# Altium project GN-1866-A-V2_HI3519V101.PRJPCB (part 1 of 4)
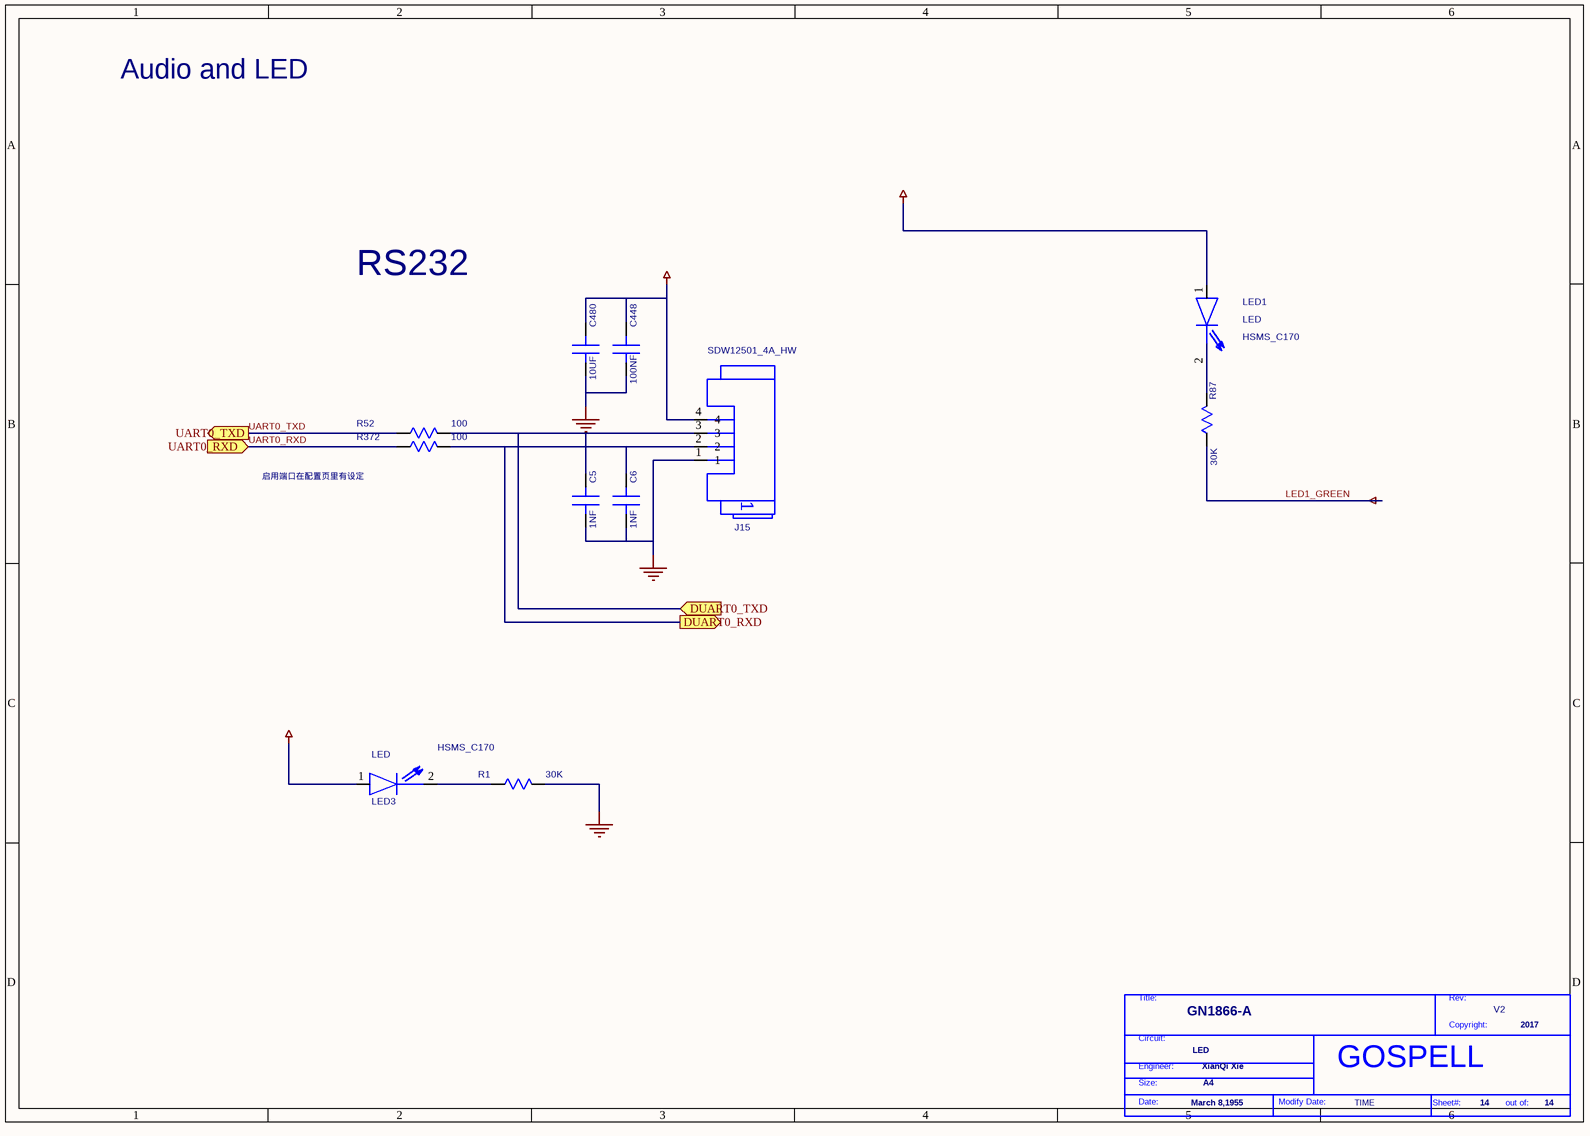
[diagram p0: P14 LED.SchDoc]
14 sheets, 339 parts. Net scope: flat (ports and power ports of the same name join across sheets).
Board file: GN-1866-A-V2.PCBDOC
Sheets:
  P14 LED.SchDoc
  P13 CONNECT.SchDoc
  P12 Spi Nor Flash.SchDoc
  P11 Peripheral of Hi351.SchDoc
  P10 VI Hi3519.SchDoc
  P09 SYS of Hi3519.SchDoc
  P08 DDR3.SchDoc
  P07 DDRC of Hi3519.SchDoc
  P06 Power&GND of Hi3519.SchDoc
  P05 Power 2.SchDoc
  P04 Power 1.SchDoc
  P03 Power Tree.SchDoc
  P02 Block Diagram.SchDoc
  P01 Note & Title.SchDoc

## Sheet P14 LED.SchDoc
size 297 x 209 mm

### Parts
(Parts that share a designator on the sheet are numbered #1, #2 ... from top to bottom, then left to right.)
*#1  Page Modify Date: TIME  Engineer: XianQi Xie  Copyright: 2017  Title: GN1866-A  RevCode: V2  Page Size: A4  Page Create Date: March 8,1955  Page Number: 14  Doc: LED  (hidden comment: GOSPELL)  (graphical)
C5  1NF  [SC0402]
C6  1NF  [SC0402]
C448  100NF  [SC0402]
C480  10UF  [SC0603]
J15  DEVICE: SDW12501_4A_HW  [4PIN-254]  (hidden comment: WBC1X41)
LED1  LED  DEVICE: HSMS_C170  [SD0805-LED]
LED3  LED  DEVICE: HSMS_C170  [SD0805-LED]
R1  30K  [SR0402]
R52  100  [SR0402]
R87  30K  [SR0402]
R372  100  [SR0402]

### Ports
DUART0_RXD (out), DUART0_TXD (in), UART0_RXD (in), UART0_TXD (out)

### Nets
3V3: C448.1(A) C480.1(A) J15.4 LED1.1(A) LED3.1(A)
GND: C5.2(B) C6.2(B) C448.2(B) C480.2(B) J15.1 R1.2(B)
LED1_GREEN: R87.1(A)
UART0_RXD: R372.1(A) ; port UART0_RXD
UART0_TXD: R52.1(A) ; port UART0_TXD
NetC5_1: C5.1(A) J15.3 R52.2(B) ; port DUART0_TXD
NetC6_1: C6.1(A) J15.2 R372.2(B) ; port DUART0_RXD
NetLED1_2: LED1.2(B) R87.2(B)
NetLED3_2: LED3.2(B) R1.1(A)

### Notes on the sheet
- Audio and LED
- RS232
- 启用端口在配置页里有设定
- (in symbol GOSPELL) Title:; Rev:; Copyright:; Circuit:; Engineer:; Size:; Date:; Modify Date:; Sheet#:; out of:

### Library data of the parts
C5 = C_0: PARTS: 1; PINSWAP: (A,B); LEVEL: STD; DEVICE: 04025C102KAT2A; OriginalSymbolOrigin: (0,30); CODE: 8070531; %195%%232%%202%%246%: SMD陶瓷电容-50V-1NF-+/-10%-X7R-0402-BT; %182%%238%%182%%168%%185%%164%%215%%247%%181%%231%%209%%185%(V): 50; COMPONENT_HIGH_MAX: 0.56MM; %208%%161%%192%%224%%195%%251%%179%%198%: SMD陶瓷电容; GVALUE: C  50V  1000pF +80%~-20%  X7R 0402; PKG_TYPE: SC0402
C6 = C_0: PARTS: 1; PINSWAP: (A,B); LEVEL: STD; DEVICE: 04025C102KAT2A; OriginalSymbolOrigin: (0,30); GVALUE: C  50V  1000pF +80%~-20%  X7R 0402; CODE: 8070531; %195%%232%%202%%246%: SMD陶瓷电容-50V-1NF-+/-10%-X7R-0402-BT; %182%%238%%182%%168%%185%%164%%215%%247%%181%%231%%209%%185%(V): 50; COMPONENT_HIGH_MAX: 0.56MM; %208%%161%%192%%224%%195%%251%%179%%198%: SMD陶瓷电容; PKG_TYPE: SC0402
C448 = C_0_Dup1: PARTS: 1; OriginalSymbolOrigin: (0,30); DEVICE: RMEMK105BJ104KV_FR; LEVEL: STD; PINSWAP: (A,B); CODE: 8070614; %195%%232%%202%%246%: SMD陶瓷电容-16V-100NF-+/-10%-X7R-0402-BT; %182%%238%%182%%168%%185%%164%%215%%247%%181%%231%%209%%185%(V): 16; COMPONENT_HIGH_MAX: 0.55MM; %208%%161%%192%%224%%195%%251%%179%%198%: SMD陶瓷电容; GVALUE: C 16V  0.1uF +80%~-20%  X7R 0402; PKG_TYPE: SC0402
C480 = C_0_Dup1: PARTS: 1; OriginalSymbolOrigin: (0,30); DEVICE: C1608X5R0J106MT0A0E; LEVEL: STD; PINSWAP: (A,B); GVALUE: C  6.3V  10uF +80%~-20%  X5R 0603; %208%%161%%192%%224%%195%%251%%179%%198%: SMD陶瓷电容; COMPONENT_HIGH_MAX: 0.9MM; %182%%238%%182%%168%%185%%164%%215%%247%%181%%231%%209%%185%(V): 6.3; %195%%232%%202%%246%: SMD陶瓷电容-6.3V-10000NF-+/-20%-X5R-0603-BT,TS16949; CODE: 8070649; PKG_TYPE: SC0603
J15 = WBC1X41_0: PARTS: 1; LEVEL: STD; PKG_TYPE: WBC0104-49T; CODE: 14100167; OriginalSymbolOrigin: (10,130); GVALUE: NC; %195%%232%%202%%246%: 普通插座-4PIN-单排-直式-1.25MM-2MM-THT-1A; COMPONENT_HIGH_MAX: 4.2MM; %208%%161%%192%%224%%195%%251%%179%%198%: 普通插座
LED1 = LED_1: PARTS: 1; OriginalSymbolOrigin: (10,20); CODE: 15020062; LEVEL: STD; GVALUE: SLED DIODE0805 绿色; %195%%232%%202%%246%: 发光二极管-0.015CD-红色/630NM-15MA-0805; COMPONENT_HIGH_MAX: 1.1MM; %208%%161%%192%%224%%195%%251%%179%%198%: 发光二极管; PKG_TYPE: SD0805-LED
LED3 = LED_1: PARTS: 1; OriginalSymbolOrigin: (10,20); CODE: 15020062; LEVEL: STD; GVALUE: SLED DIODE0805 绿色; %208%%161%%192%%224%%195%%251%%179%%198%: 发光二极管; COMPONENT_HIGH_MAX: 1.1MM; %195%%232%%202%%246%: 发光二极管-0.015CD-红色/630NM-15MA-0805; PKG_TYPE: SD0805-LED
R1 = R_0: PARTS: 1; OriginalSymbolOrigin: (10,20); PINSWAP: (A,B); DEVICE: RC0603JR_07510R; PKG_TYPE: SR0603; LEVEL: STD; GVALUE: R 1/16W 30K±5% 0402; %208%%161%%192%%224%%195%%251%%179%%198%: 片式厚膜电阻器; COMPONENT_HIGH_MAX: 0.55MM; %215%%232%%214%%181%%212%%202%%208%%237%%198%%171%%178%%238%: +/-5%; %182%%238%%182%%168%%185%%166%%194%%202%(W): 0.1; %195%%232%%202%%246%: 片式厚膜电阻器-0.1W-510OHM-+/-5%-0603; CODE: 7090638
R52 = R_1: PARTS: 1; OriginalSymbolOrigin: (10,20); PINSWAP: (A,B); DEVICE: RC0402FR_0733RL; LEVEL: STD; GVALUE: R 1/16W 100±5% 0402; CODE: 7090836; %195%%232%%202%%246%: 片式厚膜电阻器-0.0625W-33OHM-+/-1%-0402; %182%%238%%182%%168%%185%%166%%194%%202%(W): 0.06; %215%%232%%214%%181%%212%%202%%208%%237%%198%%171%%178%%238%: +/-1%; COMPONENT_HIGH_MAX: 0.4MM; %208%%161%%192%%224%%195%%251%%179%%198%: 片式厚膜电阻器; PKG_TYPE: SR0402
R87 = R_0: PARTS: 1; OriginalSymbolOrigin: (10,20); PINSWAP: (A,B); DEVICE: RK73B1ELTP472J; LEVEL: STD; GVALUE: R 1/16W 30K±5% 0402; %208%%161%%192%%224%%195%%251%%179%%198%: 片式厚膜电阻器; COMPONENT_HIGH_MAX: 0.4MM; %215%%232%%214%%181%%212%%202%%208%%237%%198%%171%%178%%238%: +/-5%; %182%%238%%182%%168%%185%%166%%194%%202%(W): 0.06; %195%%232%%202%%246%: 片式厚膜电阻器-0.0625W-4700OHM-+/-5%-0402-BT; CODE: 7090793; PKG_TYPE: SR0402
R372 = R_1: PARTS: 1; OriginalSymbolOrigin: (10,20); PINSWAP: (A,B); DEVICE: RC0402FR_0733RL; LEVEL: STD; GVALUE: R 1/16W 100±5% 0402; %208%%161%%192%%224%%195%%251%%179%%198%: 片式厚膜电阻器; COMPONENT_HIGH_MAX: 0.4MM; %215%%232%%214%%181%%212%%202%%208%%237%%198%%171%%178%%238%: +/-1%; %182%%238%%182%%168%%185%%166%%194%%202%(W): 0.06; %195%%232%%202%%246%: 片式厚膜电阻器-0.0625W-33OHM-+/-1%-0402; CODE: 7090836; PKG_TYPE: SR0402
*#1 = GOSPELL: Page Count: 14; Cage Code: 2017

## Sheet P13 CONNECT.SchDoc
size 420 x 297 mm
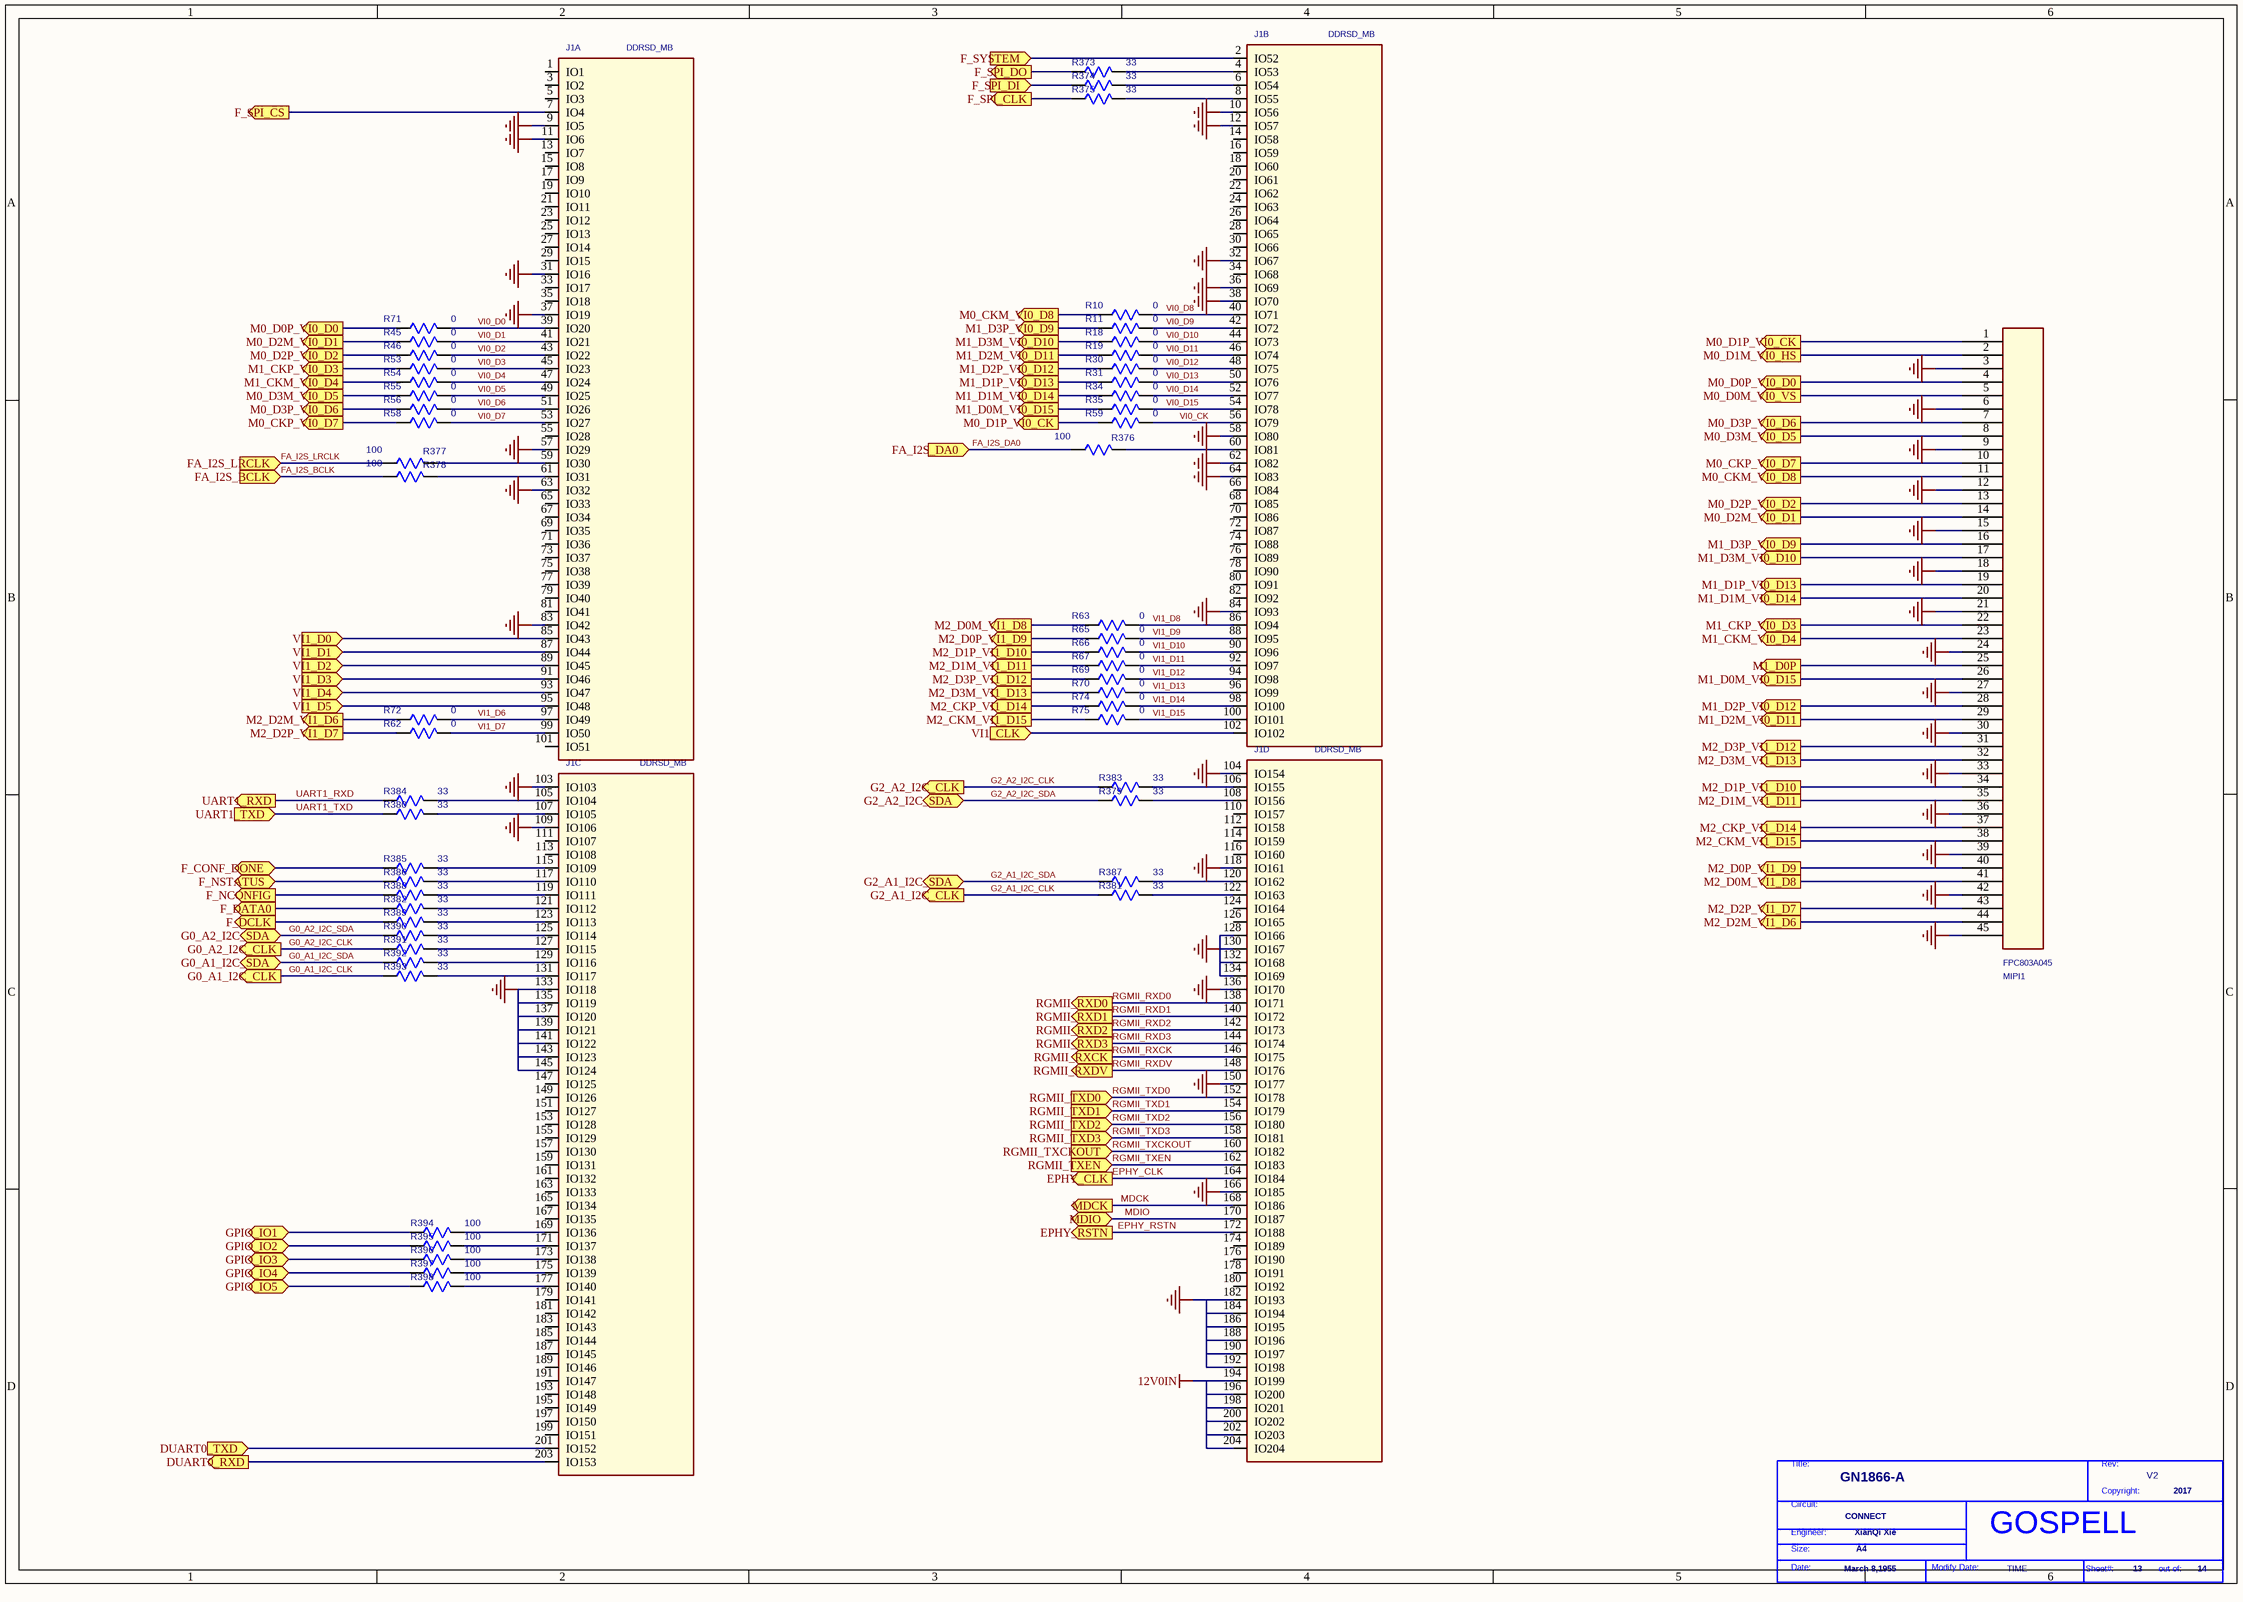
[diagram p1: P13 CONNECT.SchDoc]

### Parts
(Parts that share a designator on the sheet are numbered #1, #2 ... from top to bottom, then left to right.)
*#2  Page Modify Date: TIME  Engineer: XianQi Xie  Copyright: 2017  Title: GN1866-A  RevCode: V2  Page Size: A4  Page Create Date: March 8,1955  Page Number: 13  Page Count: 14  Doc: CONNECT  (hidden comment: GOSPELL)  (graphical)
J1  DDRSD_MB  [DDR3SODI_MBH2S6]  (parts A,B,C,D of 4)
MIPI1  FPC803A045  [FPC803A045]
R10  0  [SR0402]
R11  0  [SR0402]
R18  0  [SR0402]
R19  0  [SR0402]
R30  0  [SR0402]
R31  0  [SR0402]
R34  0  [SR0402]
R35  0  [SR0402]
R45  0  [SR0402]
R46  0  [SR0402]
R53  0  [SR0402]
R54  0  [SR0402]
R55  0  [SR0402]
R56  0  [SR0402]
R58  0  [SR0402]
R59  0  [SR0402]
R62  0  [SR0402]
R63  0  [SR0402]
R65  0  [SR0402]
R66  0  [SR0402]
R67  0  [SR0402]
R69  0  [SR0402]
R70  0  [SR0402]
R71  0  [SR0402]
R72  0  [SR0402]
R74  0  [SR0402]
R75  0  [SR0402]
R373  33  [SR0402]
R374  33  [SR0402]
R375  33  [SR0402]
R376  100  [SR0402]
R377  100  [SR0402]
R378  100  [SR0402]
R379  33  [SR0402]
R380  33  [SR0402]
R381  33  [SR0402]
R382  33  [SR0402]
R383  33  [SR0402]
R384  33  [SR0402]
R385  33  [SR0402]
R386  33  [SR0402]
R387  33  [SR0402]
R388  33  [SR0402]
R389  33  [SR0402]
R390  33  [SR0402]
R391  33  [SR0402]
R392  33  [SR0402]
R393  33  [SR0402]
R394  100  [SR0402]
R395  100  [SR0402]
R396  100  [SR0402]
R397  100  [SR0402]
R398  100  [SR0402]

### Ports
DUART0_RXD (out), DUART0_TXD (in), EPHY_CLK (out), EPHY_RSTN (out), F_CONF_DONE (bidir), F_DATA0 (out), F_DCLK (out), F_NCONFIG (out), F_NSTATUS (bidir), F_SPI_CLK (out), F_SPI_CS (out), F_SPI_DI (in), F_SPI_DO (out), F_SYSTEM (in), FA_I2S_BCLK (in), FA_I2S_DA0 (in), FA_I2S_LRCLK (in), G0_A1_I2C_CLK (out), G0_A1_I2C_SDA (bidir), G0_A2_I2C_CLK (out), G0_A2_I2C_SDA (bidir), G2_A1_I2C_CLK (out), G2_A1_I2C_SDA (bidir), G2_A2_I2C_CLK (out), G2_A2_I2C_SDA (bidir), GPIO_IO1 (bidir), GPIO_IO2 (bidir), GPIO_IO3 (bidir), GPIO_IO4 (bidir), GPIO_IO5 (bidir), M0_CKM_VI0_D8 (out), M0_CKP_VI0_D7 (out), M0_D0M_VI0_VS (out), M0_D0P_VI0_D0 (out), M0_D1M_VI0_HS (out), M0_D1P_VI0_CK (out), M0_D2M_VI0_D1 (out), M0_D2P_VI0_D2 (out), M0_D3M_VI0_D5 (out), M0_D3P_VI0_D6 (out), M1_CKM_VI0_D4 (out), M1_CKP_VI0_D3 (out), M1_D0M_VI0_D15 (out), M1_D0P (out), M1_D1M_VI0_D14 (out), M1_D1P_VI0_D13 (out), M1_D2M_VI0_D11 (out), M1_D2P_VI0_D12 (out), M1_D3M_VI0_D10 (out), M1_D3P_VI0_D9 (out), M2_CKM_VI1_D15 (out), M2_CKP_VI1_D14 (out), M2_D0M_VI1_D8 (out), M2_D0P_VI1_D9 (out), M2_D1M_VI1_D11 (out), M2_D1P_VI1_D10 (out), M2_D2M_VI1_D6 (out), M2_D2P_VI1_D7 (out), M2_D3M_VI1_D13 (out), M2_D3P_VI1_D12 (out), MDCK (out), MDIO (bidir), RGMII_RXCK (out), RGMII_RXD0 (out), RGMII_RXD1 (out), RGMII_RXD2 (out), RGMII_RXD3 (out), RGMII_RXDV (out), RGMII_TXCKOUT (in), RGMII_TXD0 (in), RGMII_TXD1 (in), RGMII_TXD2 (in), RGMII_TXD3 (in), RGMII_TXEN (in), UART1_RXD (out), UART1_TXD (in), VI1_CLK (in), VI1_D0 (in), VI1_D1 (in), VI1_D2 (in), VI1_D3 (in), VI1_D4 (in), VI1_D5 (in)

### Nets
12V0IN: J1.194(IO199) J1.196(IO200) J1.198(IO201) J1.200(IO202) J1.202(IO203) J1.204(IO204)
GND: J1.9(IO5) J1.10(IO56) J1.11(IO6) J1.12(IO57) J1.31(IO16) J1.32(IO67) J1.36(IO69) J1.37(IO19) J1.38(IO70) J1.57(IO29) J1.58(IO80) J1.62(IO82) J1.63(IO32) J1.64(IO83) J1.83(IO42) J1.84(IO93) J1.103(IO103) J1.104(IO154) J1.109(IO106) J1.118(IO161) J1.128(IO166) J1.130(IO167) J1.132(IO168) J1.133(IO118) J1.134(IO169) J1.135(IO119) J1.136(IO170) J1.137(IO120) J1.139(IO121) J1.141(IO122) J1.143(IO123) J1.145(IO124) J1.150(IO177) J1.166(IO185) J1.182(IO193) J1.184(IO194) J1.186(IO195) J1.188(IO196) J1.190(IO197) J1.192(IO198) MIPI1.3 MIPI1.6 MIPI1.9 MIPI1.12 MIPI1.15 MIPI1.18 MIPI1.21 MIPI1.24 MIPI1.27 MIPI1.30 MIPI1.33 MIPI1.36 MIPI1.39 MIPI1.42 MIPI1.45
EPHY_CLK: J1.164(IO184) ; port EPHY_CLK
EPHY_RSTN: J1.172(IO188) ; port EPHY_RSTN
F_SYSTEM: J1.2(IO52) ; port F_SYSTEM
FA_I2S_BCLK: R378.2(B) ; port FA_I2S_BCLK
FA_I2S_DA0: R376.2(B) ; port FA_I2S_DA0
FA_I2S_LRCLK: R377.2(B) ; port FA_I2S_LRCLK
G0_A1_I2C_CLK: R393.1(A) ; port G0_A1_I2C_CLK
G0_A1_I2C_SDA: R392.1(A) ; port G0_A1_I2C_SDA
G0_A2_I2C_CLK: R391.1(A) ; port G0_A2_I2C_CLK
G0_A2_I2C_SDA: R390.1(A) ; port G0_A2_I2C_SDA
G2_A1_I2C_CLK: R381.1(A) ; port G2_A1_I2C_CLK
G2_A1_I2C_SDA: R387.1(A) ; port G2_A1_I2C_SDA
G2_A2_I2C_CLK: R383.1(A) ; port G2_A2_I2C_CLK
G2_A2_I2C_SDA: R379.1(A) ; port G2_A2_I2C_SDA
M0_CKM_VI0_D8: MIPI1.11 R10.2(B) ; port M0_CKM_VI0_D8
M0_CKP_VI0_D7: MIPI1.10 R58.2(B) ; port M0_CKP_VI0_D7
M0_D0M_VI0_VS: MIPI1.5 ; port M0_D0M_VI0_VS
M0_D0P_VI0_D0: MIPI1.4 R71.2(B) ; port M0_D0P_VI0_D0
M0_D1M_VI0_HS: MIPI1.2 ; port M0_D1M_VI0_HS
M0_D1P_VI0_CK: MIPI1.1 R59.2(B) ; port M0_D1P_VI0_CK
M0_D2M_VI0_D1: MIPI1.14 R45.2(B) ; port M0_D2M_VI0_D1
M0_D2P_VI0_D2: MIPI1.13 R46.2(B) ; port M0_D2P_VI0_D2
M0_D3M_VI0_D5: MIPI1.8 R55.2(B) ; port M0_D3M_VI0_D5
M0_D3P_VI0_D6: MIPI1.7 R56.2(B) ; port M0_D3P_VI0_D6
M1_CKM_VI0_D4: MIPI1.23 R54.2(B) ; port M1_CKM_VI0_D4
M1_CKP_VI0_D3: MIPI1.22 R53.2(B) ; port M1_CKP_VI0_D3
M1_D0M_VI0_D15: MIPI1.26 R35.2(B) ; port M1_D0M_VI0_D15
M1_D0P: MIPI1.25 ; port M1_D0P
M1_D1M_VI0_D14: MIPI1.20 R34.2(B) ; port M1_D1M_VI0_D14
M1_D1P_VI0_D13: MIPI1.19 R31.2(B) ; port M1_D1P_VI0_D13
M1_D2M_VI0_D11: MIPI1.29 R19.2(B) ; port M1_D2M_VI0_D11
M1_D2P_VI0_D12: MIPI1.28 R30.2(B) ; port M1_D2P_VI0_D12
M1_D3M_VI0_D10: MIPI1.17 R18.2(B) ; port M1_D3M_VI0_D10
M1_D3P_VI0_D9: MIPI1.16 R11.2(B) ; port M1_D3P_VI0_D9
M2_CKM_VI1_D15: MIPI1.38 R75.2(B) ; port M2_CKM_VI1_D15
M2_CKP_VI1_D14: MIPI1.37 R74.2(B) ; port M2_CKP_VI1_D14
M2_D0M_VI1_D8: MIPI1.41 R63.2(B) ; port M2_D0M_VI1_D8
M2_D0P_VI1_D9: MIPI1.40 R65.2(B) ; port M2_D0P_VI1_D9
M2_D1M_VI1_D11: MIPI1.35 R67.2(B) ; port M2_D1M_VI1_D11
M2_D1P_VI1_D10: MIPI1.34 R66.2(B) ; port M2_D1P_VI1_D10
M2_D2M_VI1_D6: MIPI1.44 R72.2(B) ; port M2_D2M_VI1_D6
M2_D2P_VI1_D7: MIPI1.43 R62.2(B) ; port M2_D2P_VI1_D7
M2_D3M_VI1_D13: MIPI1.32 R70.2(B) ; port M2_D3M_VI1_D13
M2_D3P_VI1_D12: MIPI1.31 R69.2(B) ; port M2_D3P_VI1_D12
MDCK: J1.168(IO186) ; port MDCK
MDIO: J1.170(IO187) ; port MDIO
RGMII_RXCK: J1.146(IO175) ; port RGMII_RXCK
RGMII_RXD0: J1.138(IO171) ; port RGMII_RXD0
RGMII_RXD1: J1.140(IO172) ; port RGMII_RXD1
RGMII_RXD2: J1.142(IO173) ; port RGMII_RXD2
RGMII_RXD3: J1.144(IO174) ; port RGMII_RXD3
RGMII_RXDV: J1.148(IO176) ; port RGMII_RXDV
RGMII_TXCKOUT: J1.160(IO182) ; port RGMII_TXCKOUT
RGMII_TXD0: J1.152(IO178) ; port RGMII_TXD0
RGMII_TXD1: J1.154(IO179) ; port RGMII_TXD1
RGMII_TXD2: J1.156(IO180) ; port RGMII_TXD2
RGMII_TXD3: J1.158(IO181) ; port RGMII_TXD3
RGMII_TXEN: J1.162(IO183) ; port RGMII_TXEN
UART1_RXD: R384.1(A) ; port UART1_RXD
UART1_TXD: R380.1(A) ; port UART1_TXD
VI0_CK: J1.56(IO79) R59.1(A)
VI0_D0: J1.39(IO20) R71.1(A)
VI0_D1: J1.41(IO21) R45.1(A)
VI0_D2: J1.43(IO22) R46.1(A)
VI0_D3: J1.45(IO23) R53.1(A)
VI0_D4: J1.47(IO24) R54.1(A)
VI0_D5: J1.49(IO25) R55.1(A)
VI0_D6: J1.51(IO26) R56.1(A)
VI0_D7: J1.53(IO27) R58.1(A)
VI0_D8: J1.40(IO71) R10.1(A)
VI0_D9: J1.42(IO72) R11.1(A)
VI0_D10: J1.44(IO73) R18.1(A)
VI0_D11: J1.46(IO74) R19.1(A)
VI0_D12: J1.48(IO75) R30.1(A)
VI0_D13: J1.50(IO76) R31.1(A)
VI0_D14: J1.52(IO77) R34.1(A)
VI0_D15: J1.54(IO78) R35.1(A)
VI1_CLK: J1.102(IO102) ; port VI1_CLK
VI1_D0: J1.85(IO43) ; port VI1_D0
VI1_D1: J1.87(IO44) ; port VI1_D1
VI1_D2: J1.89(IO45) ; port VI1_D2
VI1_D3: J1.91(IO46) ; port VI1_D3
VI1_D4: J1.93(IO47) ; port VI1_D4
VI1_D5: J1.95(IO48) ; port VI1_D5
VI1_D6: J1.97(IO49) R72.1(A)
VI1_D7: J1.99(IO50) R62.1(A)
VI1_D8: J1.86(IO94) R63.1(A)
VI1_D9: J1.88(IO95) R65.1(A)
VI1_D10: J1.90(IO96) R66.1(A)
VI1_D11: J1.92(IO97) R67.1(A)
VI1_D12: J1.94(IO98) R69.1(A)
VI1_D13: J1.96(IO99) R70.1(A)
VI1_D14: J1.98(IO100) R74.1(A)
VI1_D15: J1.100(IO101) R75.1(A)
NetC5_1: J1.201(IO152) ; port DUART0_TXD
NetC6_1: J1.203(IO153) ; port DUART0_RXD
NetJ1_4: J1.4(IO53) R373.2(B)
NetJ1_6: J1.6(IO54) R374.2(B)
NetJ1_7: J1.7(IO4) ; port F_SPI_CS
NetJ1_8: J1.8(IO55) R375.2(B)
NetJ1_59: J1.59(IO30) R377.1(A)
NetJ1_60: J1.60(IO81) R376.1(A)
NetJ1_61: J1.61(IO31) R378.1(A)
NetJ1_105: J1.105(IO104) R384.2(B)
NetJ1_106: J1.106(IO155) R383.2(B)
NetJ1_107: J1.107(IO105) R380.2(B)
NetJ1_108: J1.108(IO156) R379.2(B)
NetJ1_115: J1.115(IO109) R385.2(B)
NetJ1_117: J1.117(IO110) R386.2(B)
NetJ1_119: J1.119(IO111) R388.2(B)
NetJ1_120: J1.120(IO162) R387.2(B)
NetJ1_121: J1.121(IO112) R382.2(B)
NetJ1_122: J1.122(IO163) R381.2(B)
NetJ1_123: J1.123(IO113) R389.2(B)
NetJ1_125: J1.125(IO114) R390.2(B)
NetJ1_127: J1.127(IO115) R391.2(B)
NetJ1_129: J1.129(IO116) R392.2(B)
NetJ1_131: J1.131(IO117) R393.2(B)
NetJ1_169: J1.169(IO136) R394.2(B)
NetJ1_171: J1.171(IO137) R395.2(B)
NetJ1_173: J1.173(IO138) R396.2(B)
NetJ1_175: J1.175(IO139) R397.2(B)
NetJ1_177: J1.177(IO140) R398.2(B)
NetR245_2: R375.1(A) ; port F_SPI_CLK
NetR373_1: R373.1(A) ; port F_SPI_DO
NetR374_1: R374.1(A) ; port F_SPI_DI
NetR382_1: R382.1(A) ; port F_DATA0
NetR385_1: R385.1(A) ; port F_CONF_DONE
NetR386_1: R386.1(A) ; port F_NSTATUS
NetR388_1: R388.1(A) ; port F_NCONFIG
NetR389_1: R389.1(A) ; port F_DCLK
NetR394_1: R394.1(A) ; port GPIO_IO1
NetR395_1: R395.1(A) ; port GPIO_IO2
NetR396_1: R396.1(A) ; port GPIO_IO3
NetR397_1: R397.1(A) ; port GPIO_IO4
NetR398_1: R398.1(A) ; port GPIO_IO5

Not connected (* = marked no-connect by the designer): J1 1(IO1) 3(IO2) 5(IO3) 13(IO7) 14(IO58) 15(IO8) 16(IO59) 17(IO9) 18(IO60) 19(IO10) 20(IO61) 21(IO11) 22(IO62) 23(IO12) 24(IO63) 25(IO13) 26(IO64) 27(IO14) 28(IO65) 29(IO15) 30(IO66) 33(IO17) 34(IO68) 35(IO18) 55(IO28) 65(IO33) 66(IO84) 67(IO34) 68(IO85) 69(IO35) 70(IO86) 71(IO36) 72(IO87) 73(IO37) 74(IO88) 75(IO38) 76(IO89) 77(IO39) 78(IO90) 79(IO40) 80(IO91) 81(IO41) 82(IO92) 101(IO51) 110(IO157) 111(IO107) 112(IO158) 113(IO108) 114(IO159) 116(IO160) 124(IO164) 126(IO165) 147(IO125) 149(IO126) 151(IO127) 153(IO128) 155(IO129) 157(IO130) 159(IO131) 161(IO132) 163(IO133) 165(IO134) 167(IO135) 174(IO189) 176(IO190) 178(IO191) 179(IO141) 180(IO192) 181(IO142) 183(IO143) 185(IO144) 187(IO145) 189(IO146) 191(IO147) 193(IO148) 195(IO149) 197(IO150) 199(IO151)

### Notes on the sheet
- (in symbol GOSPELL) Title:; Rev:; Copyright:; Circuit:; Engineer:; Size:; Date:; Modify Date:; Sheet#:; out of:

### Library data of the parts
J1 = DDRSD_MB: SPLIT_INST: TRUE; SWAP_INFO: (S1+S2+S3+S4); GVALUE: NC
MIPI1 = CON40_1: GVALUE: NC
R10 R11 R18 R19 R30 R31 R34 R35 R45 R46 R53-R56 R58 R62 R63 R65-R67 R69-R72 R74 R75 = R_1: PARTS: 1; OriginalSymbolOrigin: (10,20); PINSWAP: (A,B); DEVICE: RK73B1ELTP472J; LEVEL: STD; %208%%161%%192%%224%%195%%251%%179%%198%: 片式厚膜电阻器; COMPONENT_HIGH_MAX: 0.4MM; %215%%232%%214%%181%%212%%202%%208%%237%%198%%171%%178%%238%: +/-5%; %182%%238%%182%%168%%185%%166%%194%%202%(W): 0.06; %195%%232%%202%%246%: 片式厚膜电阻器-0.0625W-4700OHM-+/-5%-0402-BT; CODE: 7090793; GVALUE: R 1/16W 0±5% 0402; PKG_TYPE: SR0402
R59 = R_1: PARTS: 1; OriginalSymbolOrigin: (10,20); PINSWAP: (A,B); DEVICE: RK73B1ELTP472J; LEVEL: STD; CODE: 7090793; %195%%232%%202%%246%: 片式厚膜电阻器-0.0625W-4700OHM-+/-5%-0402-BT; %182%%238%%182%%168%%185%%166%%194%%202%(W): 0.06; %215%%232%%214%%181%%212%%202%%208%%237%%198%%171%%178%%238%: +/-5%; COMPONENT_HIGH_MAX: 0.4MM; %208%%161%%192%%224%%195%%251%%179%%198%: 片式厚膜电阻器; GVALUE: R 1/16W 0±5% 0402; PKG_TYPE: SR0402
R373-R375 R379-R381 R384-R387 R390-R393 = R_1: PARTS: 1; OriginalSymbolOrigin: (10,20); PINSWAP: (A,B); DEVICE: RC0402FR_0733RL; LEVEL: STD; %208%%161%%192%%224%%195%%251%%179%%198%: 片式厚膜电阻器; COMPONENT_HIGH_MAX: 0.4MM; %215%%232%%214%%181%%212%%202%%208%%237%%198%%171%%178%%238%: +/-1%; %182%%238%%182%%168%%185%%166%%194%%202%(W): 0.06; %195%%232%%202%%246%: 片式厚膜电阻器-0.0625W-33OHM-+/-1%-0402; CODE: 7090836; GVALUE: R 1/16W 33±5% 0402; PKG_TYPE: SR0402
R376 R377 = R_1: PARTS: 1; OriginalSymbolOrigin: (10,20); PINSWAP: (A,B); DEVICE: RK73B1ELTP472J; LEVEL: STD; CODE: 7090793; %195%%232%%202%%246%: 片式厚膜电阻器-0.0625W-4700OHM-+/-5%-0402-BT; %182%%238%%182%%168%%185%%166%%194%%202%(W): 0.06; %215%%232%%214%%181%%212%%202%%208%%237%%198%%171%%178%%238%: +/-5%; COMPONENT_HIGH_MAX: 0.4MM; %208%%161%%192%%224%%195%%251%%179%%198%: 片式厚膜电阻器; GVALUE: R 1/16W 100±5% 0402; PKG_TYPE: SR0402
R378 = R_1: PARTS: 1; OriginalSymbolOrigin: (10,20); PINSWAP: (A,B); DEVICE: RK73B1ELTP472J; LEVEL: STD; %208%%161%%192%%224%%195%%251%%179%%198%: 片式厚膜电阻器; COMPONENT_HIGH_MAX: 0.4MM; %215%%232%%214%%181%%212%%202%%208%%237%%198%%171%%178%%238%: +/-5%; %182%%238%%182%%168%%185%%166%%194%%202%(W): 0.06; %195%%232%%202%%246%: 片式厚膜电阻器-0.0625W-4700OHM-+/-5%-0402-BT; CODE: 7090793; GVALUE: R 1/16W 100±5% 0402; PKG_TYPE: SR0402
R382 R388 R389 = R_1: PARTS: 1; OriginalSymbolOrigin: (10,20); PINSWAP: (A,B); DEVICE: RC0402FR_0733RL; LEVEL: STD; CODE: 7090836; %195%%232%%202%%246%: 片式厚膜电阻器-0.0625W-33OHM-+/-1%-0402; %182%%238%%182%%168%%185%%166%%194%%202%(W): 0.06; %215%%232%%214%%181%%212%%202%%208%%237%%198%%171%%178%%238%: +/-1%; COMPONENT_HIGH_MAX: 0.4MM; %208%%161%%192%%224%%195%%251%%179%%198%: 片式厚膜电阻器; GVALUE: R 1/16W 33±5% 0402; PKG_TYPE: SR0402
R383 = R_1: PARTS: 1; OriginalSymbolOrigin: (10,20); PINSWAP: (A,B); DEVICE: RC0402FR_0733RL; LEVEL: STD; GVALUE: R 1/16W 33±5% 0402; CODE: 7090836; %195%%232%%202%%246%: 片式厚膜电阻器-0.0625W-33OHM-+/-1%-0402; %182%%238%%182%%168%%185%%166%%194%%202%(W): 0.06; %215%%232%%214%%181%%212%%202%%208%%237%%198%%171%%178%%238%: +/-1%; COMPONENT_HIGH_MAX: 0.4MM; %208%%161%%192%%224%%195%%251%%179%%198%: 片式厚膜电阻器; PKG_TYPE: SR0402
R394-R398 = R_1: PARTS: 1; OriginalSymbolOrigin: (10,20); PINSWAP: (A,B); DEVICE: RC0402FR_0733RL; LEVEL: STD; CODE: 7090836; %195%%232%%202%%246%: 片式厚膜电阻器-0.0625W-33OHM-+/-1%-0402; %182%%238%%182%%168%%185%%166%%194%%202%(W): 0.06; %215%%232%%214%%181%%212%%202%%208%%237%%198%%171%%178%%238%: +/-1%; COMPONENT_HIGH_MAX: 0.4MM; %208%%161%%192%%224%%195%%251%%179%%198%: 片式厚膜电阻器; GVALUE: R 1/16W 100±5% 0402; PKG_TYPE: SR0402
*#2 = GOSPELL: Cage Code: 2017

## Sheet P12 Spi Nor Flash.SchDoc
size 420 x 297 mm
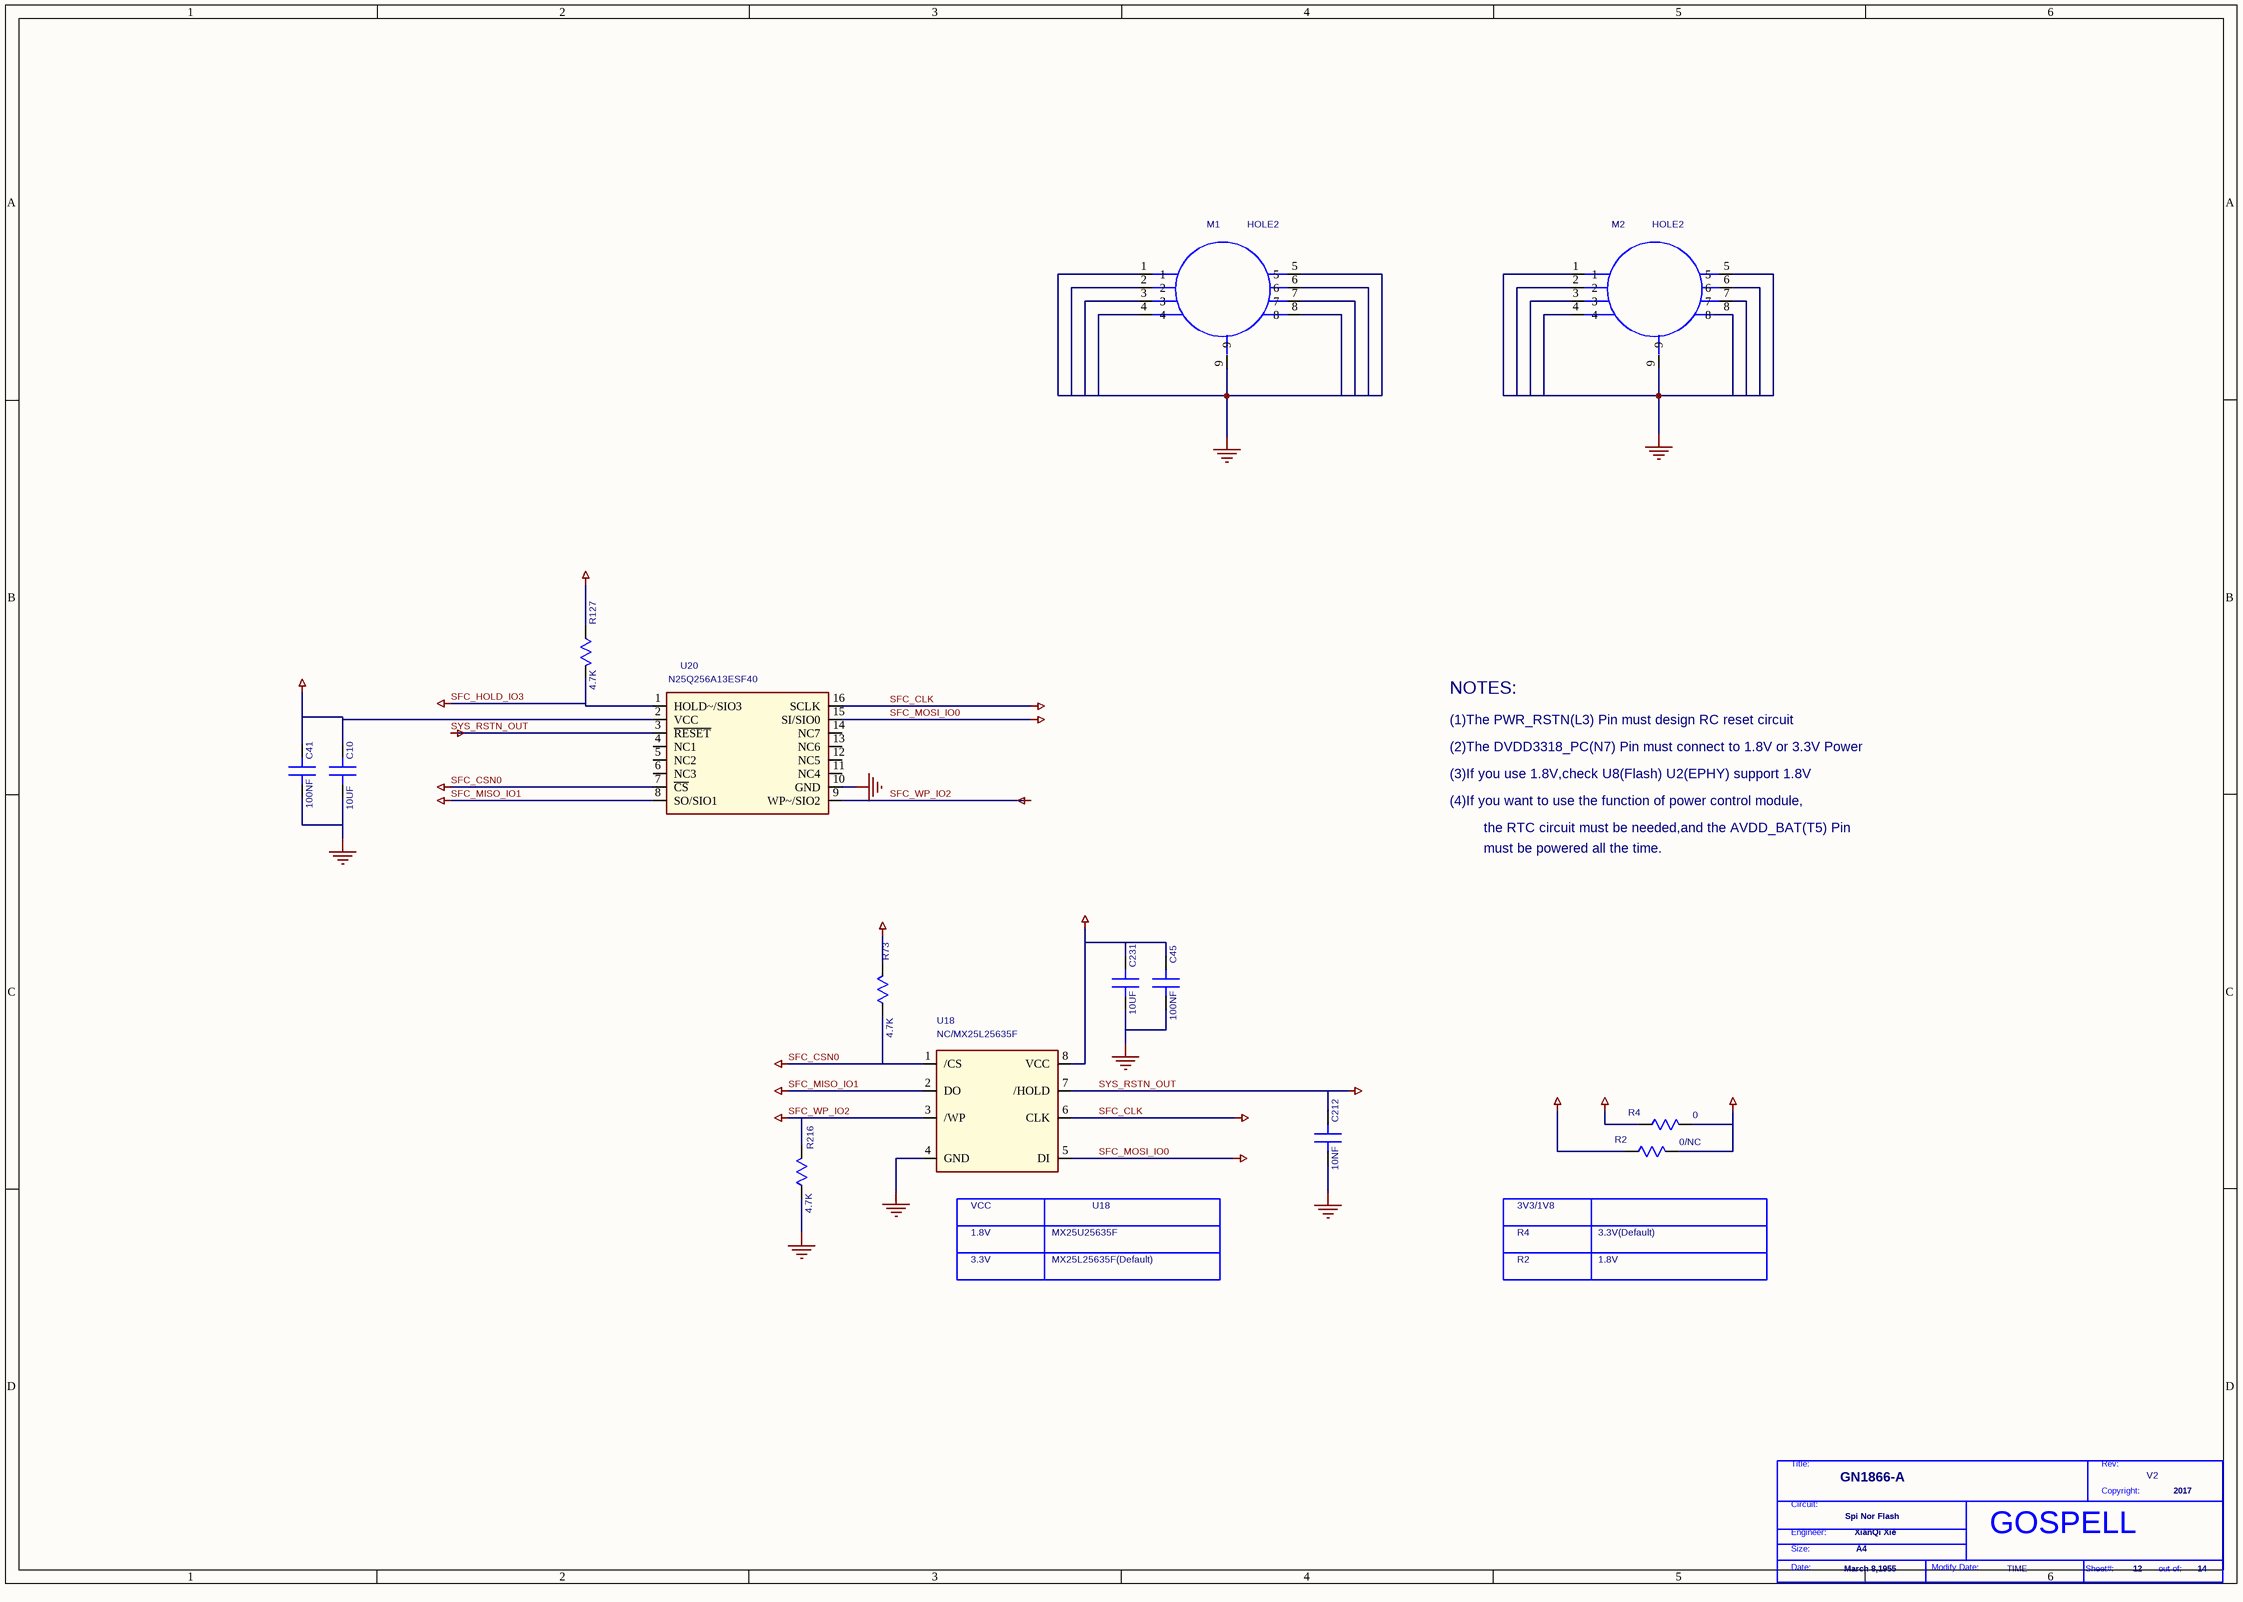
[diagram p2: P12 Spi Nor Flash.SchDoc]

### Parts
(Parts that share a designator on the sheet are numbered #1, #2 ... from top to bottom, then left to right.)
*#3  Page Modify Date: TIME  Engineer: XianQi Xie  Copyright: 2017  Title: GN1866-A  RevCode: V2  Page Size: A4  Page Create Date: March 8,1955  Page Number: 12  Page Count: 14  Doc: Spi Nor Flash  (hidden comment: GOSPELL)  (graphical)
C10  10UF  [SC0603]
C41  100NF  [SC0402]
C45  100NF  [SC0402]
C212  10NF  [SC0402]
C231  10UF  [SC0603]
M1  DEVICE: HOLE2  [HOLE160-8STARAN]  (hidden comment: NC)
M2  DEVICE: HOLE2  [HOLE160-8STARAN]  (hidden comment: NC)
R2  0/NC  [SR0402]
R4  0  [SR0402]
R73  4.7K  [SR0402]
R127  4.7K  [SR0402]
R216  4.7K  [SR0402]
U18  DEVICE: NC/MX25L25635F  [WSON8-50-0806L]  (hidden comment: W25Q128BV)
U20  DEVICE: N25Q256A13ESF40  [SOP16-50-300A]  (hidden comment: MX25L25635EMI-12G)

### Nets
1V8: R2.1(A)
3V3: R4.1(A)
3V3/1V8: C10.1(A) C41.1(A) C45.1(A) C231.1(A) R2.2(B) R4.2(B) R73.2(B) R127.1(A) U18.8(VCC) U20.2(VCC)
GND: C10.2(B) C41.2(B) C45.2(B) C212.2(B) C231.2(B) M1.1 M1.2 M1.3 M1.4 M1.5 M1.6 M1.7 M1.8 M1.9 M2.1 M2.2 M2.3 M2.4 M2.5 M2.6 M2.7 M2.8 M2.9 R216.1(A) U18.4(GND) U20.10(GND)
SFC_CLK: U18.6(CLK) U20.16(SCLK)
SFC_CSN0: R73.1(A) U18.1(/CS) U20.7(~{CS})
SFC_HOLD_IO3: R127.2(B) U20.1(HOLD~/SIO3)
SFC_MISO_IO1: U18.2(DO) U20.8(SO/SIO1)
SFC_MOSI_IO0: U18.5(DI) U20.15(SI/SIO0)
SFC_WP_IO2: R216.2(B) U18.3(/WP) U20.9(WP~/SIO2)
SYS_RSTN_OUT: C212.1(A) U18.7(/HOLD) U20.3(~{RESET})

Not connected (* = marked no-connect by the designer): U20 4(NC1) 5(NC2) 6(NC3) 11(NC4) 12(NC5) 13(NC6) 14(NC7)

### Notes on the sheet
- (1)The PWR_RSTN(L3) Pin must design RC reset circuit
- NOTES:
- (3)If you use 1.8V,check U8(Flash) U2(EPHY) support 1.8V
- (2)The DVDD3318_PC(N7) Pin must connect to 1.8V or 3.3V Power
- (4)If you want to use the function of power control module,
- the RTC circuit must be needed,and the AVDD_BAT(T5) Pin
- must be powered all the time.
- (near U18) VCC
- U18
- 3V3/1V8
- 3.3V
- 1.8V
- MX25L25635F(Default)
- MX25U25635F
- R2
- R4
- 3.3V(Default)
- (in symbol GOSPELL) Title:; Rev:; Copyright:; Circuit:; Engineer:; Size:; Date:; Modify Date:; Sheet#:; out of:

### Library data of the parts
C10 = C_0: PARTS: 1; PINSWAP: (A,B); LEVEL: STD; DEVICE: C1608X5R0J106MT0A0E; OriginalSymbolOrigin: (0,30); %208%%161%%192%%224%%195%%251%%179%%198%: SMD陶瓷电容; COMPONENT_HIGH_MAX: 0.9MM; %182%%238%%182%%168%%185%%164%%215%%247%%181%%231%%209%%185%(V): 6.3; %195%%232%%202%%246%: SMD陶瓷电容-6.3V-10000NF-+/-20%-X5R-0603-BT,TS16949; CODE: 8070649; GVALUE: C  6.3V  10uF +80%~-20%  X5R 0603; PKG_TYPE: SC0603
C41 = C_0_Dup1: PARTS: 1; OriginalSymbolOrigin: (0,30); DEVICE: RMEMK105BJ104KV_FR; LEVEL: STD; PINSWAP: (A,B); GVALUE: C 16V  0.1uF +80%~-20%  X7R 0402; %208%%161%%192%%224%%195%%251%%179%%198%: SMD陶瓷电容; COMPONENT_HIGH_MAX: 0.55MM; %182%%238%%182%%168%%185%%164%%215%%247%%181%%231%%209%%185%(V): 16; %195%%232%%202%%246%: SMD陶瓷电容-16V-100NF-+/-10%-X7R-0402-BT; CODE: 8070614; PKG_TYPE: SC0402
C45 = C_0_Dup2: PARTS: 1; OriginalSymbolOrigin: (0,30); DEVICE: RMEMK105BJ104KV_FR; LEVEL: STD; PINSWAP: (A,B); GVALUE: C 16V  0.1uF +80%~-20%  X7R 0402; %208%%161%%192%%224%%195%%251%%179%%198%: SMD陶瓷电容; COMPONENT_HIGH_MAX: 0.55MM; %182%%238%%182%%168%%185%%164%%215%%247%%181%%231%%209%%185%(V): 16; %195%%232%%202%%246%: SMD陶瓷电容-16V-100NF-+/-10%-X7R-0402-BT; CODE: 8070614; PKG_TYPE: SC0402
C212 = C_0_Dup2: PARTS: 1; OriginalSymbolOrigin: (0,30); DEVICE: GRM155R71C103KA01D; LEVEL: STD; PINSWAP: (A,B); CODE: 8070449; %195%%232%%202%%246%: SMD陶瓷电容-16V-10NF-+/-10%-X7R-0402-BT,TS16949; %182%%238%%182%%168%%185%%164%%215%%247%%181%%231%%209%%185%(V): 16; COMPONENT_HIGH_MAX: 0.56MM; %208%%161%%192%%224%%195%%251%%179%%198%: SMD陶瓷电容; GVALUE: C 16V  0.01uF +80%~-20%  X7R 0402; PKG_TYPE: SC0402
C231 = C_0_Dup2: PARTS: 1; OriginalSymbolOrigin: (0,30); DEVICE: C1608X5R0J106MT0A0E; LEVEL: STD; PINSWAP: (A,B); %208%%161%%192%%224%%195%%251%%179%%198%: SMD陶瓷电容; COMPONENT_HIGH_MAX: 0.9MM; %182%%238%%182%%168%%185%%164%%215%%247%%181%%231%%209%%185%(V): 6.3; %195%%232%%202%%246%: SMD陶瓷电容-6.3V-10000NF-+/-20%-X5R-0603-BT,TS16949; CODE: 8070649; GVALUE: C  6.3V  10uF +80%~-20%  X5R 0603; PKG_TYPE: SC0603
M1 M2 = HOLE2_2: PARTS: 1; OriginalSymbolOrigin: (0,89); LEVEL: STD; PKG_TYPE: MTH_C6MMD3P2MM; GVALUE: NC
R2 = R_0: PARTS: 1; OriginalSymbolOrigin: (10,20); PINSWAP: (A,B); DEVICE: RC0402JR_070R; LEVEL: STD; CODE: 7090800; %195%%232%%202%%246%: 片式厚膜电阻器-0.0625W-0OHM-< 50MOHM-0402-1A-BT; %182%%238%%182%%168%%185%%166%%194%%202%(W): 0.06; %215%%232%%214%%181%%212%%202%%208%%237%%198%%171%%178%%238%: < 50MOHM; COMPONENT_HIGH_MAX: 0.4MM; %208%%161%%192%%224%%195%%251%%179%%198%: 片式厚膜电阻器; GVALUE: NC; PKG_TYPE: SR0402
R4 = R_0: PARTS: 1; OriginalSymbolOrigin: (10,20); PINSWAP: (A,B); DEVICE: RC0402JR_070R; LEVEL: STD; %208%%161%%192%%224%%195%%251%%179%%198%: 片式厚膜电阻器; COMPONENT_HIGH_MAX: 0.4MM; %215%%232%%214%%181%%212%%202%%208%%237%%198%%171%%178%%238%: < 50MOHM; %182%%238%%182%%168%%185%%166%%194%%202%(W): 0.06; %195%%232%%202%%246%: 片式厚膜电阻器-0.0625W-0OHM-< 50MOHM-0402-1A-BT; CODE: 7090800; GVALUE: R 1/16W 0±5% 0402; PKG_TYPE: SR0402
R73 R216 = R_0: PARTS: 1; OriginalSymbolOrigin: (10,20); PINSWAP: (A,B); DEVICE: RK73B1ELTP472J; LEVEL: STD; CODE: 7090793; %195%%232%%202%%246%: 片式厚膜电阻器-0.0625W-4700OHM-+/-5%-0402-BT; %182%%238%%182%%168%%185%%166%%194%%202%(W): 0.06; %215%%232%%214%%181%%212%%202%%208%%237%%198%%171%%178%%238%: +/-5%; COMPONENT_HIGH_MAX: 0.4MM; %208%%161%%192%%224%%195%%251%%179%%198%: 片式厚膜电阻器; GVALUE: R 1/16W 4.7K±5% 0402; PKG_TYPE: SR0402
R127 = R_1: PARTS: 1; OriginalSymbolOrigin: (10,20); PINSWAP: (A,B); DEVICE: RK73B1ELTP472J; LEVEL: STD; CODE: 7090793; %195%%232%%202%%246%: 片式厚膜电阻器-0.0625W-4700OHM-+/-5%-0402-BT; %182%%238%%182%%168%%185%%166%%194%%202%(W): 0.06; %215%%232%%214%%181%%212%%202%%208%%237%%198%%171%%178%%238%: +/-5%; COMPONENT_HIGH_MAX: 0.4MM; %208%%161%%192%%224%%195%%251%%179%%198%: 片式厚膜电阻器; GVALUE: R 1/16W 4.7K±5% 0402; PKG_TYPE: SR0402
U18 = W25Q128BV_0: PARTS: 1; OriginalSymbolOrigin: (-5,110); LEVEL: STD; %195%%232%%202%%246%: MX25L25635-10G 256MBIT; CODE: HBVT3002; GVALUE: NC; PKG_TYPE: WSON8-50-0806L
U20 = MX25L25635EMI-12G_1: PARTS: 1; OriginalSymbolOrigin: (10,100); LEVEL: STD; CODE: HBVT3001; %195%%232%%202%%246%: SPI FLASH-256MBIT-50MHZ-64KB-3.3V-SOP16L-00425847; COMPONENT_HIGH_MAX: 2.65MM; GVALUE: N25Q256A13ESF40  WSO16 SPI FLASH; PKG_TYPE: SOP16-50-300A
*#3 = GOSPELL: Cage Code: 2017

## Sheet P11 Peripheral of Hi351.SchDoc
size 420 x 297 mm
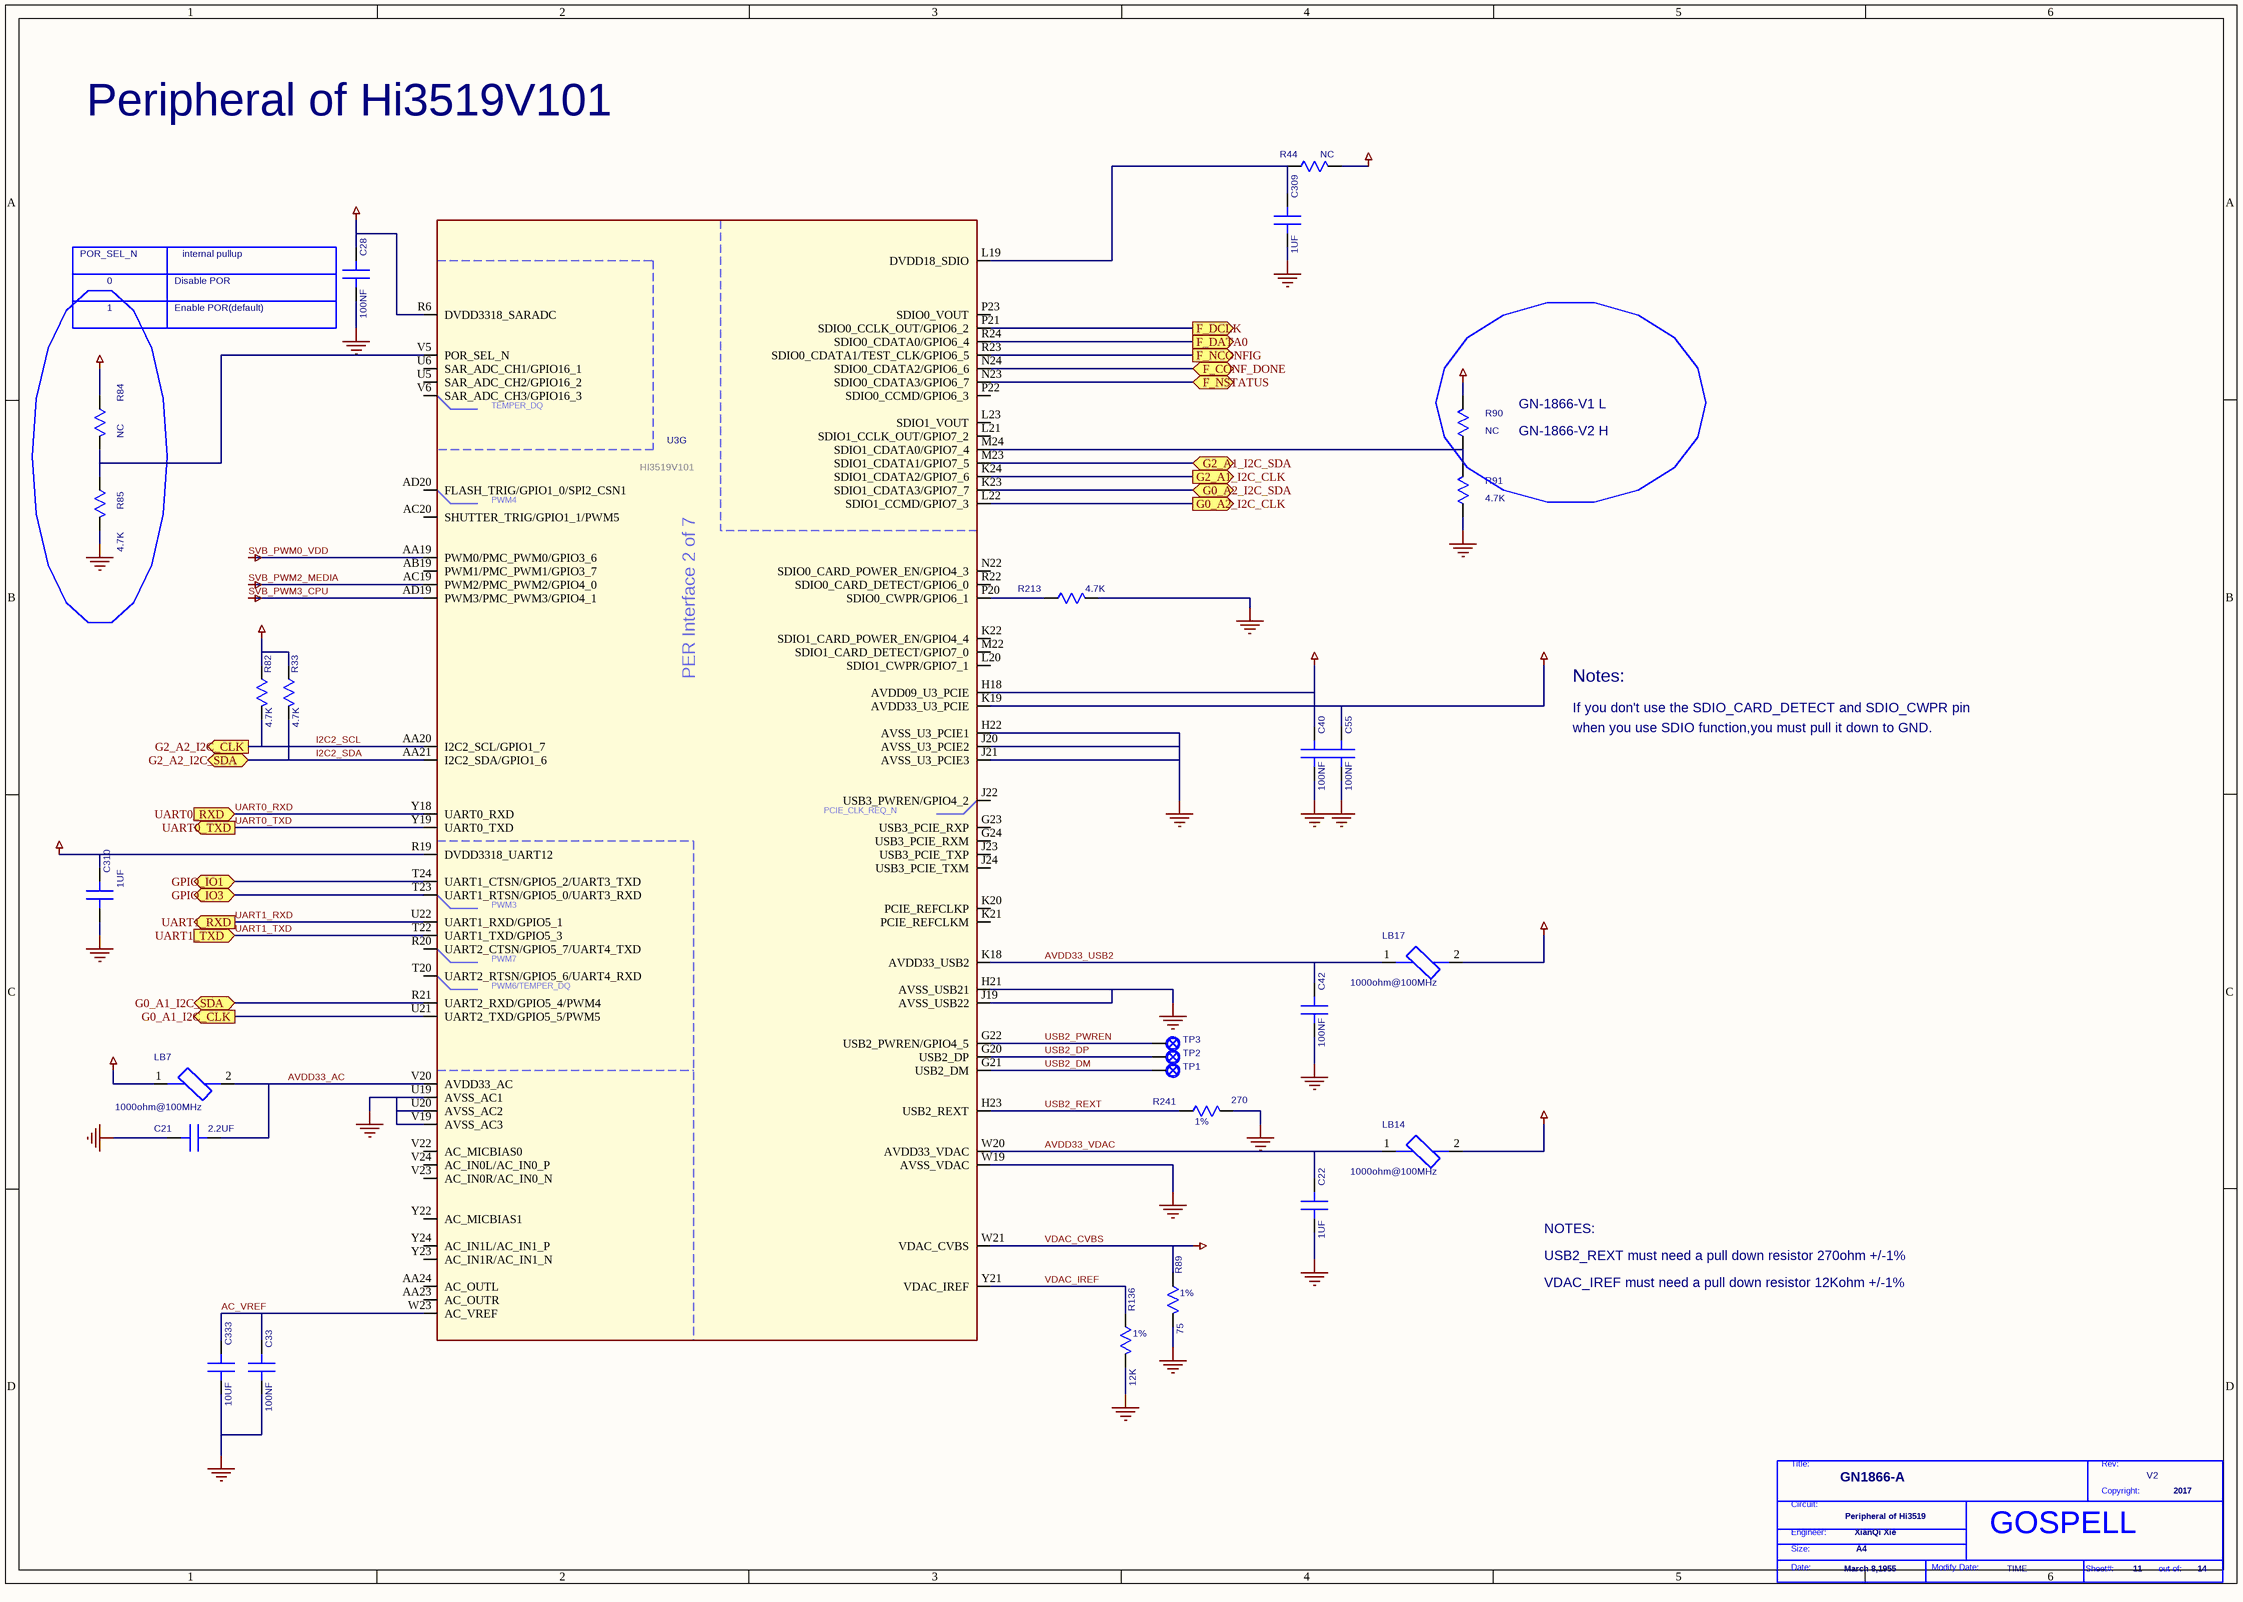
[diagram p3: P11 Peripheral of Hi351.SchDoc]

### Parts
(Parts that share a designator on the sheet are numbered #1, #2 ... from top to bottom, then left to right.)
*#4  Page Modify Date: TIME  Engineer: XianQi Xie  Copyright: 2017  Title: GN1866-A  RevCode: V2  Page Size: A4  Page Create Date: March 8,1955  Page Number: 11  Page Count: 14  Doc: Peripheral of Hi3519  (hidden comment: GOSPELL)  (graphical)
C21  2.2UF  [SC0402]
C22  1UF  [HSC0201]
C28  100NF  [HSC0201]
C33  100NF  [HSC0201]
C40  100NF  [HSC0201]
C42  100NF  [HSC0201]
C55  100NF  [HSC0201]
C309  1UF  [HSC0201]
C310  1UF  [HSC0201]
C333  10UF  [SC0603]
LB7  LB  [HSL0201-TB]  (value not drawn)
LB14  LB  [HSL0201-TB]  (value not drawn)
LB17  LB  [HSL0201-TB]  (value not drawn)
R33  4.7K  [SR0402]
R44  NC  [SR0402]
R82  4.7K  [SR0402]
R84  NC  [SR0402]
R85  4.7K  [SR0402]
R89  75  [SR0402]
R90  NC  [SR0402]
R91  4.7K  [SR0402]
R136  12K  [SR0402]
R213  4.7K  [SR0402]
R241  270  [SC0402]
TP1  TESTPOINT  [TP24-SMD]  (value not drawn)
TP2  TESTPOINT  [TP24-SMD]  (value not drawn)
TP3  TESTPOINT  [TP24-SMD]  (value not drawn)
U3  DEVICE: HI3519V101  [HBGA524-16-2424]  (hidden comment: HI3519V101_PER)  (part G of 7)

### Ports
F_CONF_DONE (bidir), F_DATA0 (out), F_DCLK (out), F_NCONFIG (out), F_NSTATUS (bidir), G0_A1_I2C_CLK (out), G0_A1_I2C_SDA (bidir), G0_A2_I2C_CLK (out), G0_A2_I2C_SDA (bidir), G2_A1_I2C_CLK (out), G2_A1_I2C_SDA (bidir), G2_A2_I2C_CLK (out), G2_A2_I2C_SDA (bidir), GPIO_IO1 (bidir), GPIO_IO3 (bidir), UART0_RXD (in), UART0_TXD (out), UART1_RXD (out), UART1_TXD (in)

### Nets
1V8: R44.2(B)
3V3: C28.2(B) C55.1(A) C310.1(A) LB7.1 LB14.2 LB17.2 R33.1(A) R82.1(A) R84.1(A) R90.2(B) U3.K19(AVDD33_U3_PCIE) U3.R6(DVDD3318_SARADC) U3.R19(DVDD3318_UART12)
GND: C21.1(A) C22.2(B) C28.1(A) C33.2(B) C40.2(B) C42.2(B) C55.2(B) C309.2(B) C310.2(B) C333.2(B) R85.2(B) R89.2(B) R91.1(A) R136.2(B) R213.2(B) R241.2(B) U3.H21(AVSS_USB21) U3.H22(AVSS_U3_PCIE1) U3.J19(AVSS_USB22) U3.J20(AVSS_U3_PCIE2) U3.J21(AVSS_U3_PCIE3) U3.U19(AVSS_AC1) U3.U20(AVSS_AC2) U3.V19(AVSS_AC3) U3.W19(AVSS_VDAC)
SVB_PWM0_VDD: U3.AA19(PWM0/PMC_PWM0/GPIO3_6)
SVB_PWM2_MEDIA: U3.AC19(PWM2/PMC_PWM2/GPIO4_0)
SVB_PWM3_CPU: U3.AD19(PWM3/PMC_PWM3/GPIO4_1)
VCC_VDD_DDR_CORE: C40.1(A) U3.H18(AVDD09_U3_PCIE)
VDAC_CVBS: R89.1(A) U3.W21(VDAC_CVBS)
AC_VREF: C33.1(A) C333.1(A) U3.W23(AC_VREF)
AVDD33_AC: C21.2(B) LB7.2 U3.V20(AVDD33_AC)
AVDD33_USB2: C42.1(A) LB17.1 U3.K18(AVDD33_USB2)
AVDD33_VDAC: C22.1(A) LB14.1 U3.W20(AVDD33_VDAC)
G0_A1_I2C_CLK: U3.U21(UART2_TXD/GPIO5_5/PWM5) ; port G0_A1_I2C_CLK
G0_A1_I2C_SDA: U3.R21(UART2_RXD/GPIO5_4/PWM4) ; port G0_A1_I2C_SDA
G0_A2_I2C_CLK: U3.L22(SDIO1_CCMD/GPIO7_3) ; port G0_A2_I2C_CLK
G0_A2_I2C_SDA: U3.K23(SDIO1_CDATA3/GPIO7_7) ; port G0_A2_I2C_SDA
G2_A1_I2C_CLK: U3.K24(SDIO1_CDATA2/GPIO7_6) ; port G2_A1_I2C_CLK
G2_A1_I2C_SDA: U3.M23(SDIO1_CDATA1/GPIO7_5) ; port G2_A1_I2C_SDA
I2C2_SCL: R82.2(B) U3.AA20(I2C2_SCL/GPIO1_7) ; port G2_A2_I2C_CLK  [project net G2_A2_I2C_CLK]
I2C2_SDA: R33.2(B) U3.AA21(I2C2_SDA/GPIO1_6) ; port G2_A2_I2C_SDA  [project net G2_A2_I2C_SDA]
UART0_RXD: U3.Y18(UART0_RXD) ; port UART0_RXD
UART0_TXD: U3.Y19(UART0_TXD) ; port UART0_TXD
UART1_RXD: U3.U22(UART1_RXD/GPIO5_1) ; port UART1_RXD
UART1_TXD: U3.T22(UART1_TXD/GPIO5_3) ; port UART1_TXD
USB2_DM: TP1.1 U3.G21(USB2_DM)
USB2_DP: TP2.1 U3.G20(USB2_DP)
USB2_PWREN: TP3.1 U3.G22(USB2_PWREN/GPIO4_5)
USB2_REXT: R241.1(A) U3.H23(USB2_REXT)
VDAC_IREF: R136.1(A) U3.Y21(VDAC_IREF)
NetC309_1: C309.1(A) R44.1(A) U3.L19(DVDD18_SDIO)
NetR84_2: R84.2(B) R85.1(A) U3.V5(POR_SEL_N)
NetR90_1: R90.1(A) R91.2(B) U3.M24(SDIO1_CDATA0/GPIO7_4)
NetR213_1: R213.1(A) U3.P20(SDIO0_CWPR/GPIO6_1)
NetR382_1: U3.R24(SDIO0_CDATA0/GPIO6_4) ; port F_DATA0
NetR385_1: U3.N24(SDIO0_CDATA2/GPIO6_6) ; port F_CONF_DONE
NetR386_1: U3.N23(SDIO0_CDATA3/GPIO6_7) ; port F_NSTATUS
NetR388_1: U3.R23(SDIO0_CDATA1/TEST_CLK/GPIO6_5) ; port F_NCONFIG
NetR389_1: U3.P21(SDIO0_CCLK_OUT/GPIO6_2) ; port F_DCLK
NetR394_1: U3.T24(UART1_CTSN/GPIO5_2/UART3_TXD) ; port GPIO_IO1
NetR396_1: U3.T23(UART1_RTSN/GPIO5_0/UART3_RXD) ; port GPIO_IO3

Not connected (* = marked no-connect by the designer): U3 AA23(AC_OUTR) AA24(AC_OUTL) AB19(PWM1/PMC_PWM1/GPIO3_7) AC20(SHUTTER_TRIG/GPIO1_1/PWM5) AD20(FLASH_TRIG/GPIO1_0/SPI2_CSN1) G23(USB3_PCIE_RXP) G24(USB3_PCIE_RXM) J22(USB3_PWREN/GPIO4_2) J23(USB3_PCIE_TXP) J24(USB3_PCIE_TXM) K20(PCIE_REFCLKP) K21(PCIE_REFCLKM) K22(SDIO1_CARD_POWER_EN/GPIO4_4) L20(SDIO1_CWPR/GPIO7_1) L21(SDIO1_CCLK_OUT/GPIO7_2) L23(SDIO1_VOUT) M22(SDIO1_CARD_DETECT/GPIO7_0) N22(SDIO0_CARD_POWER_EN/GPIO4_3) P22(SDIO0_CCMD/GPIO6_3) P23(SDIO0_VOUT) R20(UART2_CTSN/GPIO5_7/UART4_TXD) R22(SDIO0_CARD_DETECT/GPIO6_0) T20(UART2_RTSN/GPIO5_6/UART4_RXD) U5(SAR_ADC_CH2/GPIO16_2) U6(SAR_ADC_CH1/GPIO16_1) V6(SAR_ADC_CH3/GPIO16_3) V22(AC_MICBIAS0) V23(AC_IN0R/AC_IN0_N) V24(AC_IN0L/AC_IN0_P) Y22(AC_MICBIAS1) Y23(AC_IN1R/AC_IN1_N) Y24(AC_IN1L/AC_IN1_P)

### Notes on the sheet
- Peripheral of Hi3519V101
- POR_SEL_N
- internal pullup
- 1
- 0
- Enable POR(default)
- Disable POR
- GN-1866-V1 L
- GN-1866-V2 H
- when you use SDIO function,you must pull it down to GND.
- If you don't use the SDIO_CARD_DETECT and SDIO_CWPR pin
- Notes:
- (near LB17) 1000ohm@100MHz
- 1000ohm@100MHz
- (near R241) 1%
- (near LB14) 1000ohm@100MHz
- USB2_REXT must need a pull down resistor 270ohm +/-1%
- NOTES:
- (near R136) 1%
- (near R89) 1%
- VDAC_IREF must need a pull down resistor 12Kohm +/-1%
- (in symbol GOSPELL) Title:; Rev:; Copyright:; Circuit:; Engineer:; Size:; Date:; Modify Date:; Sheet#:; out of:
- (in symbol HI3519V101_PER_2, part G) TEMPER_DQ; PWM4; PER Interface 2 of 7; PCIE_CLK_REQ_N; PWM3; PWM7; PWM6/TEMPER_DQ

### Library data of the parts
C21 = C_0_Dup2: PARTS: 1; OriginalSymbolOrigin: (0,30); DEVICE: GRM155R60J225ME15D; LEVEL: STD; PINSWAP: (A,B); %208%%161%%192%%224%%195%%251%%179%%198%: SMD陶瓷电容; COMPONENT_HIGH_MAX: 0.6MM; %182%%238%%182%%168%%185%%164%%215%%247%%181%%231%%209%%185%(V): 6.3; %195%%232%%202%%246%: SMD陶瓷电容-6.3V-2200NF-+/-20%-X5R-0402-TS16949; CODE: 8070667; GVALUE: C  6.3V  2.2uF +80%~-20%  X5R 0402; PKG_TYPE: SC0402
C22 = C_0_Dup2: PARTS: 1; OriginalSymbolOrigin: (0,30); DEVICE: CM03X5R105M06AH_A; LEVEL: STD; PINSWAP: (A,B); %208%%161%%192%%224%%195%%251%%179%%198%: SMD陶瓷电容; COMPONENT_HIGH_MAX: 0.35MM; %182%%238%%182%%168%%185%%164%%215%%247%%181%%231%%209%%185%(V): 6.3; %195%%232%%202%%246%: SMD陶瓷电容-4V-1000NF-+/-20%-X5R-0201(0.65MM*0.35MM*0.35MM)-终端专用; CODE: 8071128; GVALUE: C  4V  1uF +80%~-20%  X5R 0201(0.65MM*0.35MM*0.35MM); PKG_TYPE: HSC0201
C28 C42 C55 = C_0_Dup2: PARTS: 1; OriginalSymbolOrigin: (0,30); DEVICE: GRM033R60J104KE19D; LEVEL: STD; PINSWAP: (A,B); CODE: 8070704; %195%%232%%202%%246%: SMD陶瓷电容-6.3V-100NF-+/-10%-X5R-0201-TS16949; %182%%238%%182%%168%%185%%164%%215%%247%%181%%231%%209%%185%(V): 6.3; COMPONENT_HIGH_MAX: 0.33MM; %208%%161%%192%%224%%195%%251%%179%%198%: SMD陶瓷电容; GVALUE: C  6.3V  0.1uF +80%~-20%  X5R 0201; PKG_TYPE: HSC0201
C33 C40 = C_0_Dup2: PARTS: 1; OriginalSymbolOrigin: (0,30); DEVICE: GRM033R60J104KE19D; LEVEL: STD; PINSWAP: (A,B); %208%%161%%192%%224%%195%%251%%179%%198%: SMD陶瓷电容; COMPONENT_HIGH_MAX: 0.33MM; %182%%238%%182%%168%%185%%164%%215%%247%%181%%231%%209%%185%(V): 6.3; %195%%232%%202%%246%: SMD陶瓷电容-6.3V-100NF-+/-10%-X5R-0201-TS16949; CODE: 8070704; GVALUE: C  6.3V  0.1uF +80%~-20%  X5R 0201; PKG_TYPE: HSC0201
C309 C310 = C_0_Dup2: PARTS: 1; OriginalSymbolOrigin: (0,30); DEVICE: CM03X5R105M06AH_A; LEVEL: STD; PINSWAP: (A,B); CODE: 8071128; %195%%232%%202%%246%: SMD陶瓷电容-4V-1000NF-+/-20%-X5R-0201(0.65MM*0.35MM*0.35MM)-终端专用; %182%%238%%182%%168%%185%%164%%215%%247%%181%%231%%209%%185%(V): 10; COMPONENT_HIGH_MAX: 0.35MM; %208%%161%%192%%224%%195%%251%%179%%198%: SMD陶瓷电容; GVALUE: C  4V  1uF +80%~-20%  X5R 0201(0.65MM*0.35MM*0.35MM); PKG_TYPE: HSC0201
C333 = C_0_Dup2: PARTS: 1; OriginalSymbolOrigin: (0,30); DEVICE: C1608X5R0J106MT0A0E; LEVEL: STD; PINSWAP: (A,B); CODE: 8070649; %195%%232%%202%%246%: SMD陶瓷电容-6.3V-10000NF-+/-20%-X5R-0603-BT,TS16949; %182%%238%%182%%168%%185%%164%%215%%247%%181%%231%%209%%185%(V): 6.3; COMPONENT_HIGH_MAX: 0.9MM; %208%%161%%192%%224%%195%%251%%179%%198%: SMD陶瓷电容; GVALUE: C  6.3V  10uF +80%~-20%  X5R 0603; PKG_TYPE: SC0603
LB7 LB14 LB17 = LB_0: PARTS: 1; OriginalSymbolOrigin: (20,50); LEVEL: STD; DEVICE: NOOO; %195%%232%%202%%246%: EMI磁珠-+/-25%-1000OHM-1.25OHM-0.25A-0402-1400OHM@1GHZ; COMPONENT_HIGH_MAX: 0.65MM; %208%%161%%192%%224%%195%%251%%179%%198%: EMI磁珠; GVALUE: 麦捷:0201磁珠80欧; PKG_TYPE: HSL0201-TB
R33 R85 R213 = R_0: as R73 on sheet P12 Spi Nor Flash; PKG_TYPE: SR0402
R44 R90 = R_0: PARTS: 1; OriginalSymbolOrigin: (10,20); PINSWAP: (A,B); DEVICE: RC0603JR_07300K; PKG_TYPE: SR0603; LEVEL: STD; %208%%161%%192%%224%%195%%251%%179%%198%: 片式厚膜电阻器; COMPONENT_HIGH_MAX: 0.55MM; %215%%232%%214%%181%%212%%202%%208%%237%%198%%171%%178%%238%: +/-5%; %182%%238%%182%%168%%185%%166%%194%%202%(W): 0.1; %195%%232%%202%%246%: 片式厚膜电阻器-0.1W-300000OHM-+/-5%-0603; CODE: 7090261; GVALUE: NC
R82 = R_0: PARTS: 1; OriginalSymbolOrigin: (10,20); PINSWAP: (A,B); DEVICE: RK73B1ELTP472J; LEVEL: STD; %208%%161%%192%%224%%195%%251%%179%%198%: 片式厚膜电阻器; COMPONENT_HIGH_MAX: 0.4MM; %215%%232%%214%%181%%212%%202%%208%%237%%198%%171%%178%%238%: +/-5%; %182%%238%%182%%168%%185%%166%%194%%202%(W): 0.06; %195%%232%%202%%246%: 片式厚膜电阻器-0.0625W-4700OHM-+/-5%-0402-BT; CODE: 7090793; GVALUE: R 1/16W 4.7K±5% 0402; PKG_TYPE: SR0402
R84 = R_0: PARTS: 1; OriginalSymbolOrigin: (10,20); PINSWAP: (A,B); DEVICE: RK73B1ELTP472J; LEVEL: STD; CODE: 7090793; %195%%232%%202%%246%: 片式厚膜电阻器-0.0625W-4700OHM-+/-5%-0402-BT; %182%%238%%182%%168%%185%%166%%194%%202%(W): 0.06; %215%%232%%214%%181%%212%%202%%208%%237%%198%%171%%178%%238%: +/-5%; COMPONENT_HIGH_MAX: 0.4MM; %208%%161%%192%%224%%195%%251%%179%%198%: 片式厚膜电阻器; PKG_TYPE: SR0402; GVALUE: NC
R89 = R_0: PARTS: 1; OriginalSymbolOrigin: (10,20); PINSWAP: (A,B); DEVICE: RC_02W750FT; LEVEL: STD; %208%%161%%192%%224%%195%%251%%179%%198%: 片式厚膜电阻器; COMPONENT_HIGH_MAX: 0.4MM; %215%%232%%214%%181%%212%%202%%208%%237%%198%%171%%178%%238%: +/-1%; %182%%238%%182%%168%%185%%166%%194%%202%(W): 0.06; %195%%232%%202%%246%: 片式厚膜电阻器-0.0625W-75OHM-+/-1%-0402; CODE: 7091321; GVALUE: R 1/16W 75±5% 0402; PKG_TYPE: SR0402
R91 = R_0: PARTS: 1; OriginalSymbolOrigin: (10,20); PINSWAP: (A,B); DEVICE: RC0603JR_07300K; PKG_TYPE: SR0603; LEVEL: STD; CODE: 7090261; %195%%232%%202%%246%: 片式厚膜电阻器-0.1W-300000OHM-+/-5%-0603; %182%%238%%182%%168%%185%%166%%194%%202%(W): 0.1; %215%%232%%214%%181%%212%%202%%208%%237%%198%%171%%178%%238%: +/-5%; COMPONENT_HIGH_MAX: 0.55MM; %208%%161%%192%%224%%195%%251%%179%%198%: 片式厚膜电阻器; GVALUE: R 1/16W 4.7K±5% 0402
R136 = R_0: PARTS: 1; OriginalSymbolOrigin: (10,20); PINSWAP: (A,B); DEVICE: RC0402FR_0712K; LEVEL: STD; CODE: 7090817; %195%%232%%202%%246%: 片式厚膜电阻器-0.0625W-12000OHM-+/-1%-0402; %182%%238%%182%%168%%185%%166%%194%%202%(W): 0.06; %215%%232%%214%%181%%212%%202%%208%%237%%198%%171%%178%%238%: +/-1%; COMPONENT_HIGH_MAX: 0.4MM; %208%%161%%192%%224%%195%%251%%179%%198%: 片式厚膜电阻器; GVALUE: R 1/16W 12K±5% 0402; PKG_TYPE: SR0402
R241 = R_0: PARTS: 1; OriginalSymbolOrigin: (10,20); PINSWAP: (A,B); DEVICE: RC0603FR_07270R; PKG_TYPE: SR0603; LEVEL: STD; %208%%161%%192%%224%%195%%251%%179%%198%: 片式厚膜电阻器; COMPONENT_HIGH_MAX: 0.55MM; %215%%232%%214%%181%%212%%202%%208%%237%%198%%171%%178%%238%: +/-1%; %182%%238%%182%%168%%185%%166%%194%%202%(W): 0.1; %195%%232%%202%%246%: 片式厚膜电阻器-0.1W-270OHM-+/-1%-0603-TS16949; CODE: 7090602; GVALUE: R 1/16W 270±1% 0402
TP1-TP3 = TESTPOINT_0: PARTS: 1; OriginalSymbolOrigin: (20,20); LEVEL: STD; DEVICE: TEST-SMD; GVALUE: NC; PKG_TYPE: TP24-SMD
U3 = HI3519V101_PER_2: PARTS: 1; OriginalSymbolOrigin: (0,840); LEVEL: STD; HETERO: (HI3519V101_PWR),(HI3519V101_DDR),(HI3519V101_SYS),(HI3519V101_VIVO),(HI3519V101_PER),(HI3519V101_VSS1),(HI3519V101_VSS2); CaptureCellPackProp: HI3519V101_PERG; COMPONENT_HIGH_MAX: 0.98MM; %195%%232%%202%%246%: 请注意是HDI板，建库的时候请注意下-02323838; CODE: G01428016_MODZH; FORWARD_PCB: 1; PKG_TYPE: HBGA524-16-2424; GVALUE: HI3519V101_PER
*#4 = GOSPELL: Cage Code: 2017

## Sheet P10 VI Hi3519.SchDoc
size 420 x 297 mm
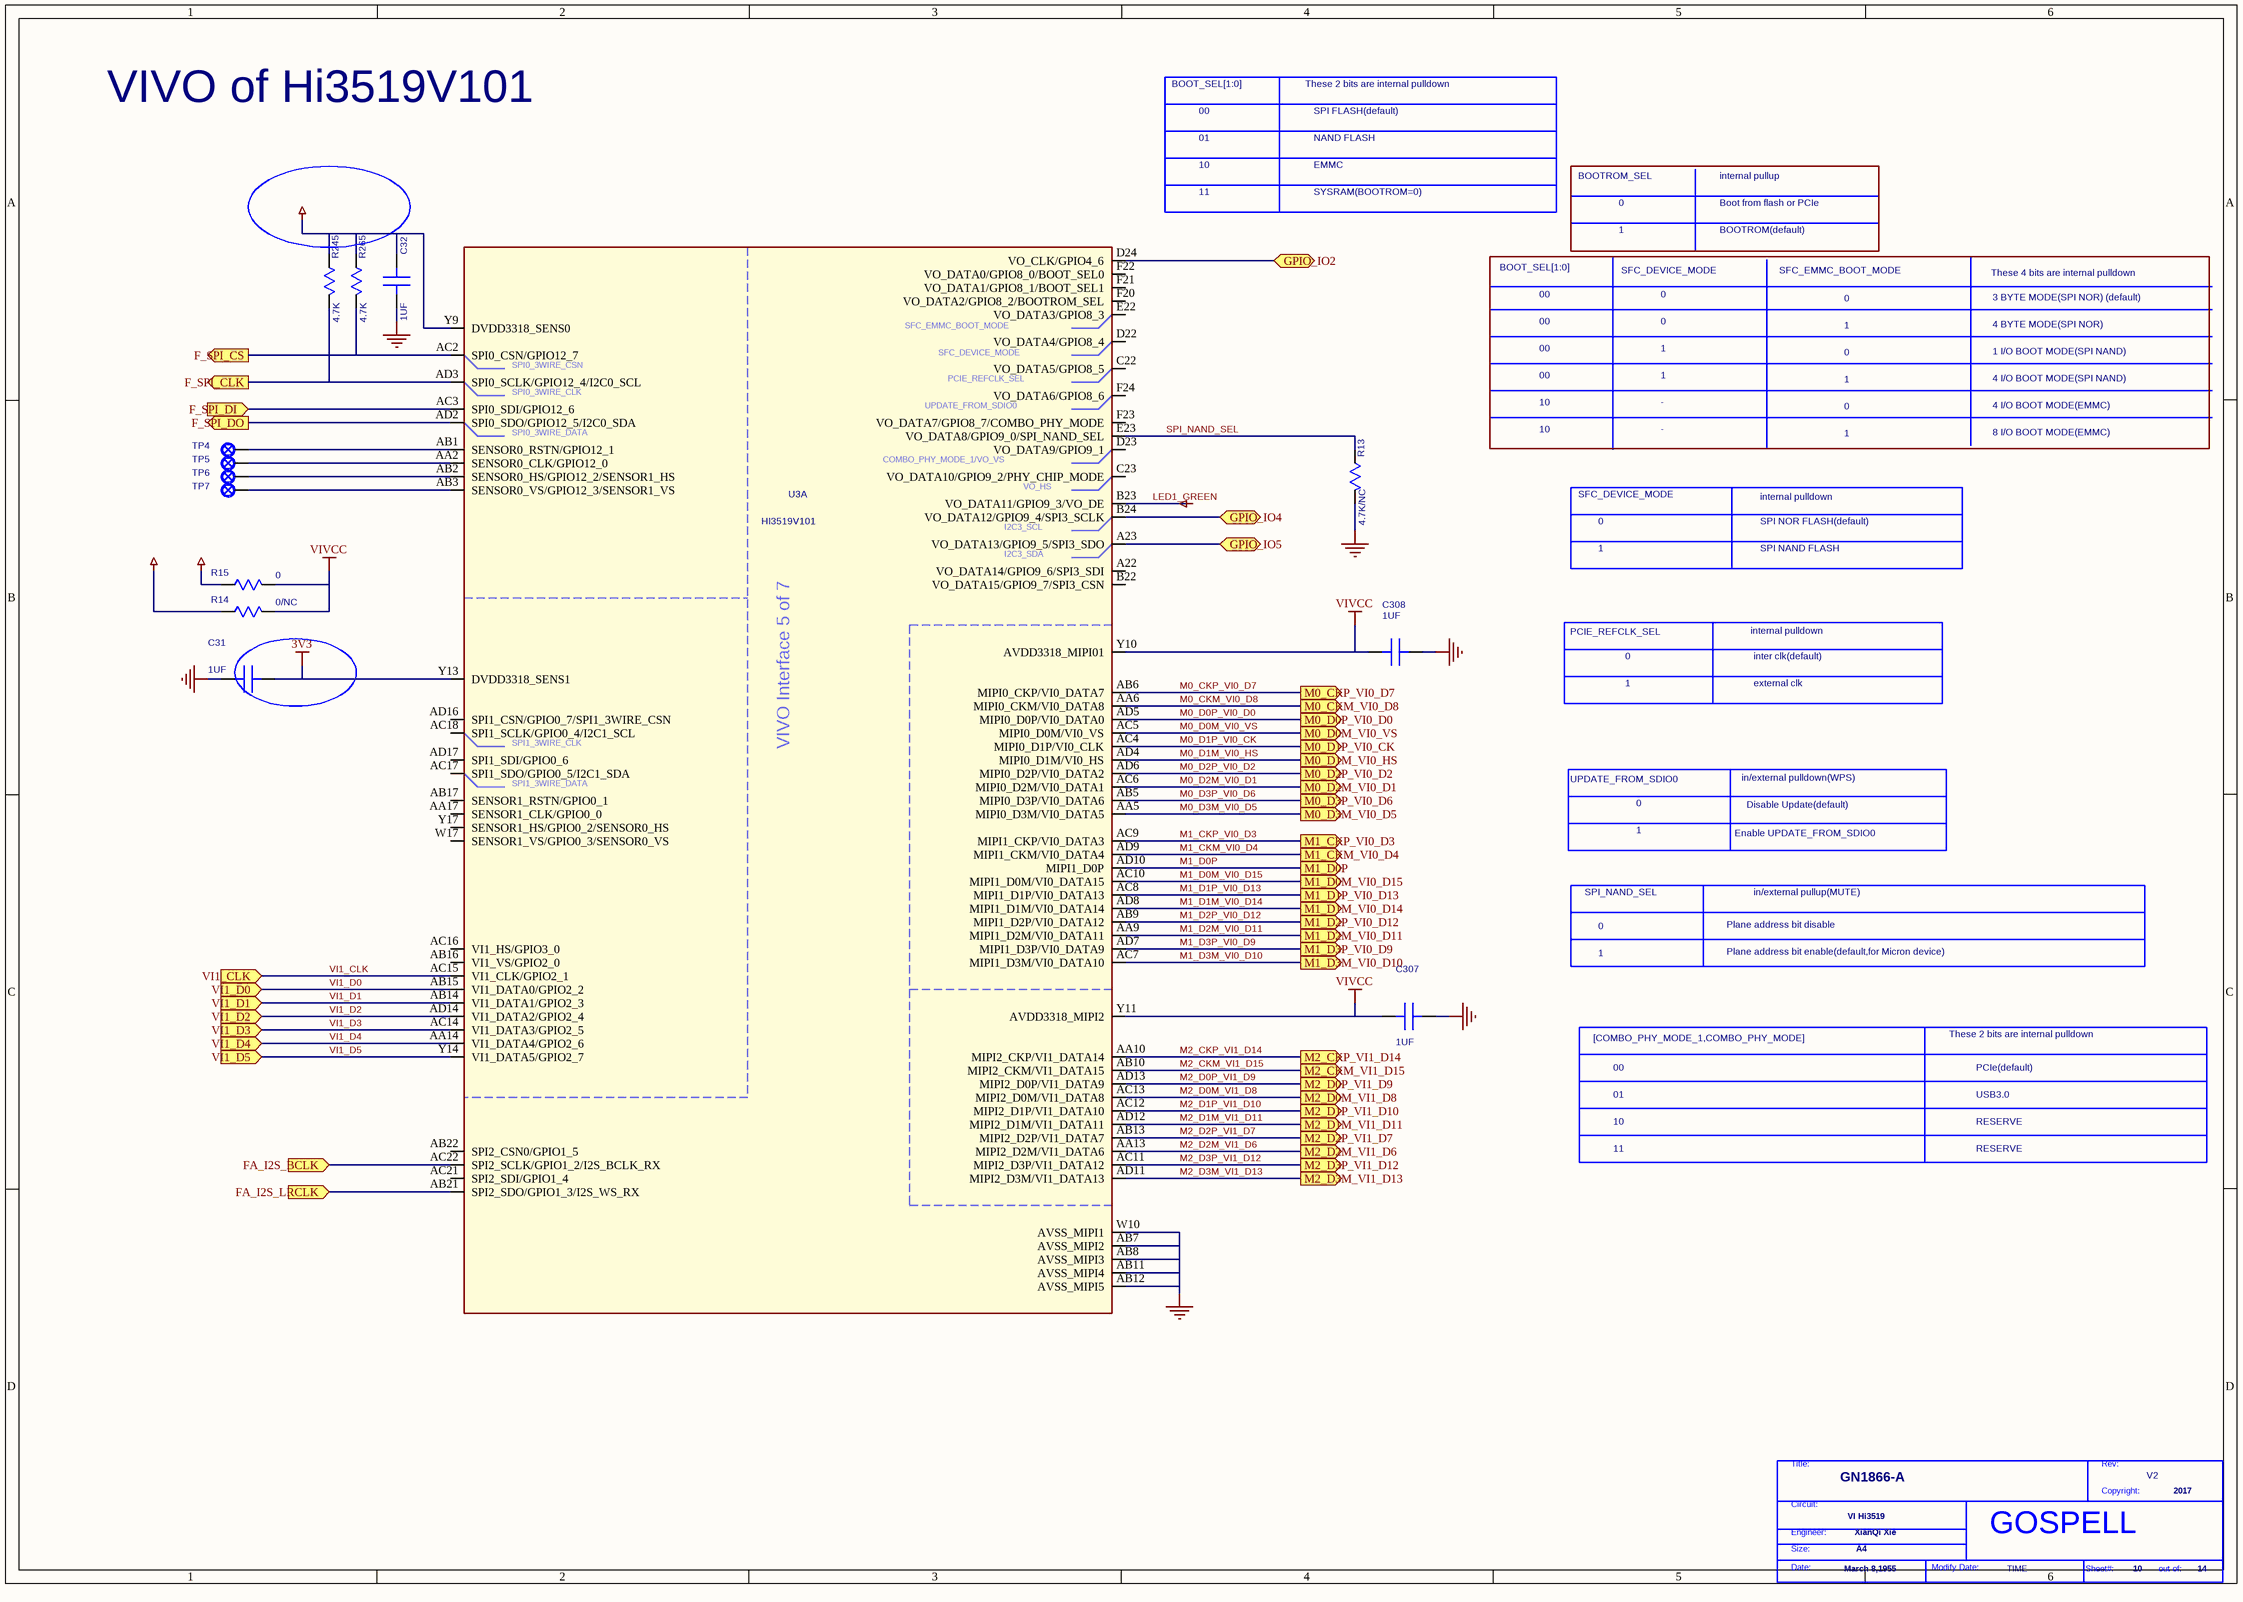
[diagram p4: P10 VI Hi3519.SchDoc]

### Parts
(Parts that share a designator on the sheet are numbered #1, #2 ... from top to bottom, then left to right.)
*#5  Page Modify Date: TIME  Engineer: XianQi Xie  Copyright: 2017  Title: GN1866-A  RevCode: V2  Page Size: A4  Page Create Date: March 8,1955  Page Number: 10  Page Count: 14  Doc: VI Hi3519  (hidden comment: GOSPELL)  (graphical)
C31  1UF  [HSC0201]
C32  1UF  [HSC0201]
C307  1UF  [HSC0201]
C308  1UF  [HSC0201]
R13  4.7K/NC  [SR0402]
R14  0/NC  [SR0402]
R15  0  [SR0402]
R245  4.7K  [SR0402]
R265  4.7K  [SR0402]
TP4  TESTPOINT  [TP24-SMD]  (value not drawn)
TP5  TESTPOINT  [TP24-SMD]  (value not drawn)
TP6  TESTPOINT  [TP24-SMD]  (value not drawn)
TP7  TESTPOINT  [TP24-SMD]  (value not drawn)
U3  DEVICE: HI3519V101  [HBGA524-16-2424]  (hidden comment: HI3519V101_PER)  (part A of 7)

### Ports
F_SPI_CLK (out), F_SPI_CS (out), F_SPI_DI (in), F_SPI_DO (out), FA_I2S_BCLK (in), FA_I2S_LRCLK (in), GPIO_IO2 (bidir), GPIO_IO4 (bidir), GPIO_IO5 (bidir), M0_CKM_VI0_D8 (out), M0_CKP_VI0_D7 (out), M0_D0M_VI0_VS (out), M0_D0P_VI0_D0 (out), M0_D1M_VI0_HS (out), M0_D1P_VI0_CK (out), M0_D2M_VI0_D1 (out), M0_D2P_VI0_D2 (out), M0_D3M_VI0_D5 (out), M0_D3P_VI0_D6 (out), M1_CKM_VI0_D4 (out), M1_CKP_VI0_D3 (out), M1_D0M_VI0_D15 (out), M1_D0P (out), M1_D1M_VI0_D14 (out), M1_D1P_VI0_D13 (out), M1_D2M_VI0_D11 (out), M1_D2P_VI0_D12 (out), M1_D3M_VI0_D10 (out), M1_D3P_VI0_D9 (out), M2_CKM_VI1_D15 (out), M2_CKP_VI1_D14 (out), M2_D0M_VI1_D8 (out), M2_D0P_VI1_D9 (out), M2_D1M_VI1_D11 (out), M2_D1P_VI1_D10 (out), M2_D2M_VI1_D6 (out), M2_D2P_VI1_D7 (out), M2_D3M_VI1_D13 (out), M2_D3P_VI1_D12 (out), VI1_CLK (in), VI1_D0 (in), VI1_D1 (in), VI1_D2 (in), VI1_D3 (in), VI1_D4 (in), VI1_D5 (in)

### Nets
1V8: R14.1(A)
3V3: C31.1(A) C32.1(A) R15.1(A) R245.1(A) R265.1(A) U3.Y9(DVDD3318_SENS0) U3.Y13(DVDD3318_SENS1)
GND: C31.2(B) C32.2(B) C307.2(B) C308.2(B) R13.2(B) U3.AB7(AVSS_MIPI2) U3.AB8(AVSS_MIPI3) U3.AB11(AVSS_MIPI4) U3.AB12(AVSS_MIPI5) U3.W10(AVSS_MIPI1)
LED1_GREEN: U3.B23(VO_DATA11/GPIO9_3/VO_DE)
VIVCC: C307.1(A) C308.1(A) R14.2(B) R15.2(B) U3.Y10(AVDD3318_MIPI01) U3.Y11(AVDD3318_MIPI2)
FA_I2S_BCLK: U3.AC22(SPI2_SCLK/GPIO1_2/I2S_BCLK_RX) ; port FA_I2S_BCLK
FA_I2S_LRCLK: U3.AB21(SPI2_SDO/GPIO1_3/I2S_WS_RX) ; port FA_I2S_LRCLK
M0_CKM_VI0_D8: U3.AA6(MIPI0_CKM/VI0_DATA8) ; port M0_CKM_VI0_D8
M0_CKP_VI0_D7: U3.AB6(MIPI0_CKP/VI0_DATA7) ; port M0_CKP_VI0_D7
M0_D0M_VI0_VS: U3.AC5(MIPI0_D0M/VI0_VS) ; port M0_D0M_VI0_VS
M0_D0P_VI0_D0: U3.AD5(MIPI0_D0P/VI0_DATA0) ; port M0_D0P_VI0_D0
M0_D1M_VI0_HS: U3.AD4(MIPI0_D1M/VI0_HS) ; port M0_D1M_VI0_HS
M0_D1P_VI0_CK: U3.AC4(MIPI0_D1P/VI0_CLK) ; port M0_D1P_VI0_CK
M0_D2M_VI0_D1: U3.AC6(MIPI0_D2M/VI0_DATA1) ; port M0_D2M_VI0_D1
M0_D2P_VI0_D2: U3.AD6(MIPI0_D2P/VI0_DATA2) ; port M0_D2P_VI0_D2
M0_D3M_VI0_D5: U3.AA5(MIPI0_D3M/VI0_DATA5) ; port M0_D3M_VI0_D5
M0_D3P_VI0_D6: U3.AB5(MIPI0_D3P/VI0_DATA6) ; port M0_D3P_VI0_D6
M1_CKM_VI0_D4: U3.AD9(MIPI1_CKM/VI0_DATA4) ; port M1_CKM_VI0_D4
M1_CKP_VI0_D3: U3.AC9(MIPI1_CKP/VI0_DATA3) ; port M1_CKP_VI0_D3
M1_D0M_VI0_D15: U3.AC10(MIPI1_D0M/VI0_DATA15) ; port M1_D0M_VI0_D15
M1_D0P: U3.AD10(MIPI1_D0P) ; port M1_D0P
M1_D1M_VI0_D14: U3.AD8(MIPI1_D1M/VI0_DATA14) ; port M1_D1M_VI0_D14
M1_D1P_VI0_D13: U3.AC8(MIPI1_D1P/VI0_DATA13) ; port M1_D1P_VI0_D13
M1_D2M_VI0_D11: U3.AA9(MIPI1_D2M/VI0_DATA11) ; port M1_D2M_VI0_D11
M1_D2P_VI0_D12: U3.AB9(MIPI1_D2P/VI0_DATA12) ; port M1_D2P_VI0_D12
M1_D3M_VI0_D10: U3.AC7(MIPI1_D3M/VI0_DATA10) ; port M1_D3M_VI0_D10
M1_D3P_VI0_D9: U3.AD7(MIPI1_D3P/VI0_DATA9) ; port M1_D3P_VI0_D9
M2_CKM_VI1_D15: U3.AB10(MIPI2_CKM/VI1_DATA15) ; port M2_CKM_VI1_D15
M2_CKP_VI1_D14: U3.AA10(MIPI2_CKP/VI1_DATA14) ; port M2_CKP_VI1_D14
M2_D0M_VI1_D8: U3.AC13(MIPI2_D0M/VI1_DATA8) ; port M2_D0M_VI1_D8
M2_D0P_VI1_D9: U3.AD13(MIPI2_D0P/VI1_DATA9) ; port M2_D0P_VI1_D9
M2_D1M_VI1_D11: U3.AD12(MIPI2_D1M/VI1_DATA11) ; port M2_D1M_VI1_D11
M2_D1P_VI1_D10: U3.AC12(MIPI2_D1P/VI1_DATA10) ; port M2_D1P_VI1_D10
M2_D2M_VI1_D6: U3.AA13(MIPI2_D2M/VI1_DATA6) ; port M2_D2M_VI1_D6
M2_D2P_VI1_D7: U3.AB13(MIPI2_D2P/VI1_DATA7) ; port M2_D2P_VI1_D7
M2_D3M_VI1_D13: U3.AD11(MIPI2_D3M/VI1_DATA13) ; port M2_D3M_VI1_D13
M2_D3P_VI1_D12: U3.AC11(MIPI2_D3P/VI1_DATA12) ; port M2_D3P_VI1_D12
SPI_NAND_SEL: R13.1(A) U3.E23(VO_DATA8/GPIO9_0/SPI_NAND_SEL)
VI1_CLK: U3.AC15(VI1_CLK/GPIO2_1) ; port VI1_CLK
VI1_D0: U3.AB15(VI1_DATA0/GPIO2_2) ; port VI1_D0
VI1_D1: U3.AB14(VI1_DATA1/GPIO2_3) ; port VI1_D1
VI1_D2: U3.AD14(VI1_DATA2/GPIO2_4) ; port VI1_D2
VI1_D3: U3.AC14(VI1_DATA3/GPIO2_5) ; port VI1_D3
VI1_D4: U3.AA14(VI1_DATA4/GPIO2_6) ; port VI1_D4
VI1_D5: U3.Y14(VI1_DATA5/GPIO2_7) ; port VI1_D5
NetJ1_7: R265.2(B) U3.AC2(SPI0_CSN/GPIO12_7) ; port F_SPI_CS
NetR245_2: R245.2(B) U3.AD3(SPI0_SCLK/GPIO12_4/I2C0_SCL) ; port F_SPI_CLK
NetR373_1: U3.AD2(SPI0_SDO/GPIO12_5/I2C0_SDA) ; port F_SPI_DO
NetR374_1: U3.AC3(SPI0_SDI/GPIO12_6) ; port F_SPI_DI
NetR395_1: U3.D24(VO_CLK/GPIO4_6) ; port GPIO_IO2
NetR397_1: U3.B24(VO_DATA12/GPIO9_4/SPI3_SCLK) ; port GPIO_IO4
NetR398_1: U3.A23(VO_DATA13/GPIO9_5/SPI3_SDO) ; port GPIO_IO5
NetTP4_1: TP4.1 U3.AB1(SENSOR0_RSTN/GPIO12_1)
NetTP5_1: TP5.1 U3.AA2(SENSOR0_CLK/GPIO12_0)
NetTP6_1: TP6.1 U3.AB2(SENSOR0_HS/GPIO12_2/SENSOR1_HS)
NetTP7_1: TP7.1 U3.AB3(SENSOR0_VS/GPIO12_3/SENSOR1_VS)

Not connected (* = marked no-connect by the designer): U3 A22(VO_DATA14/GPIO9_6/SPI3_SDI) AA17(SENSOR1_CLK/GPIO0_0) AB16(VI1_VS/GPIO2_0) AB17(SENSOR1_RSTN/GPIO0_1) AB22(SPI2_CSN0/GPIO1_5) AC16(VI1_HS/GPIO3_0) AC17(SPI1_SDO/GPIO0_5/I2C1_SDA) AC18(SPI1_SCLK/GPIO0_4/I2C1_SCL) AC21(SPI2_SDI/GPIO1_4) AD16(SPI1_CSN/GPIO0_7/SPI1_3WIRE_CSN) AD17(SPI1_SDI/GPIO0_6) B22(VO_DATA15/GPIO9_7/SPI3_CSN) C22(VO_DATA5/GPIO8_5) C23(VO_DATA10/GPIO9_2/PHY_CHIP_MODE) D22(VO_DATA4/GPIO8_4) D23(VO_DATA9/GPIO9_1) E22(VO_DATA3/GPIO8_3) F20(VO_DATA2/GPIO8_2/BOOTROM_SEL) F21(VO_DATA1/GPIO8_1/BOOT_SEL1) F22(VO_DATA0/GPIO8_0/BOOT_SEL0) F23(VO_DATA7/GPIO8_7/COMBO_PHY_MODE) F24(VO_DATA6/GPIO8_6) W17(SENSOR1_VS/GPIO0_3/SENSOR0_VS) Y17(SENSOR1_HS/GPIO0_2/SENSOR0_HS)

### Notes on the sheet
- VIVO of Hi3519V101
- BOOT_SEL[1:0]
- 00
- These 2 bits are internal pulldown
- SPI FLASH(default)
- 01
- 10
- 11
- SYSRAM(BOOTROM=0)
- EMMC
- NAND FLASH
- BOOTROM_SEL
- internal pullup
- 1
- 0
- BOOTROM(default)
- Boot from flash or PCIe
- SFC_DEVICE_MODE
- SFC_EMMC_BOOT_MODE
- These 4 bits are internal pulldown
- 4 BYTE MODE(SPI NOR)
- 3 BYTE MODE(SPI NOR) (default)
- 4 I/O BOOT MODE(SPI NAND)
- 1 I/O BOOT MODE(SPI NAND)
- -
- 8 I/O BOOT MODE(EMMC)
- 4 I/O BOOT MODE(EMMC)
- internal pulldown
- SPI NOR FLASH(default)
- SPI NAND FLASH
- PCIE_REFCLK_SEL
- inter clk(default)
- external clk
- UPDATE_FROM_SDIO0
- in/external pulldown(WPS)
- Enable UPDATE_FROM_SDIO0
- Disable Update(default)
- SPI_NAND_SEL
- Plane address bit disable
- in/external pullup(MUTE)
- Plane address bit enable(default,for Micron device)
- [COMBO_PHY_MODE_1,COMBO_PHY_MODE]
- PCIe(default)
- USB3.0
- RESERVE
- (in symbol GOSPELL) Title:; Rev:; Copyright:; Circuit:; Engineer:; Size:; Date:; Modify Date:; Sheet#:; out of:
- (in symbol HI3519V101_PER_2, part A) SFC_EMMC_BOOT_MODE; SFC_DEVICE_MODE; SPI0_3WIRE_CSN; PCIE_REFCLK_SEL; SPI0_3WIRE_CLK; UPDATE_FROM_SDIO0; SPI0_3WIRE_DATA; COMBO_PHY_MODE_1/VO_VS; VO_HS; I2C3_SCL; I2C3_SDA; SPI1_3WIRE_CLK; VIVO Interface 5 of 7; SPI1_3WIRE_DATA

### Library data of the parts
C31 C32 = C_0_Dup2: PARTS: 1; OriginalSymbolOrigin: (0,30); DEVICE: CM03X5R105M06AH_A; LEVEL: STD; PINSWAP: (A,B); CODE: 8071128; %195%%232%%202%%246%: SMD陶瓷电容-4V-1000NF-+/-20%-X5R-0201(0.65MM*0.35MM*0.35MM)-终端专用; %182%%238%%182%%168%%185%%164%%215%%247%%181%%231%%209%%185%(V): 6.3; COMPONENT_HIGH_MAX: 0.35MM; %208%%161%%192%%224%%195%%251%%179%%198%: SMD陶瓷电容; GVALUE: C  4V  1uF +80%~-20%  X5R 0201(0.65MM*0.35MM*0.35MM); PKG_TYPE: HSC0201
C307 = C_0_Dup2: as C309 on sheet P11 Peripheral of Hi351; PKG_TYPE: HSC0201
C308 = C_0_Dup2: PARTS: 1; OriginalSymbolOrigin: (0,30); DEVICE: CM03X5R105M06AH_A; LEVEL: STD; PINSWAP: (A,B); %208%%161%%192%%224%%195%%251%%179%%198%: SMD陶瓷电容; COMPONENT_HIGH_MAX: 0.35MM; %182%%238%%182%%168%%185%%164%%215%%247%%181%%231%%209%%185%(V): 10; %195%%232%%202%%246%: SMD陶瓷电容-4V-1000NF-+/-20%-X5R-0201(0.65MM*0.35MM*0.35MM)-终端专用; CODE: 8071128; GVALUE: C  4V  1uF +80%~-20%  X5R 0201(0.65MM*0.35MM*0.35MM); PKG_TYPE: HSC0201
R13 = R_0: PARTS: 1; OriginalSymbolOrigin: (10,20); PINSWAP: (A,B); DEVICE: RK73B1ELTP472J; LEVEL: STD; CODE: 7090793; %195%%232%%202%%246%: 片式厚膜电阻器-0.0625W-4700OHM-+/-5%-0402-BT; %182%%238%%182%%168%%185%%166%%194%%202%(W): 0.06; %215%%232%%214%%181%%212%%202%%208%%237%%198%%171%%178%%238%: +/-5%; COMPONENT_HIGH_MAX: 0.4MM; %208%%161%%192%%224%%195%%251%%179%%198%: 片式厚膜电阻器; GVALUE: NC; PKG_TYPE: SR0402
R14 = R_0: PARTS: 1; OriginalSymbolOrigin: (10,20); PINSWAP: (A,B); DEVICE: RC0402JR_070R; LEVEL: STD; %208%%161%%192%%224%%195%%251%%179%%198%: 片式厚膜电阻器; COMPONENT_HIGH_MAX: 0.4MM; %215%%232%%214%%181%%212%%202%%208%%237%%198%%171%%178%%238%: < 50MOHM; %182%%238%%182%%168%%185%%166%%194%%202%(W): 0.06; %195%%232%%202%%246%: 片式厚膜电阻器-0.0625W-0OHM-< 50MOHM-0402-1A-BT; CODE: 7090800; GVALUE: NC; PKG_TYPE: SR0402
R15 = R_0: as R4 on sheet P12 Spi Nor Flash; PKG_TYPE: SR0402
R245 R265 = R_0: as R73 on sheet P12 Spi Nor Flash; PKG_TYPE: SR0402
TP4-TP7 = TESTPOINT_0: as TP1 on sheet P11 Peripheral of Hi351; PKG_TYPE: TP24-SMD
U3 = HI3519V101_PER_2: PARTS: 1; OriginalSymbolOrigin: (0,840); LEVEL: STD; HETERO: (HI3519V101_PWR),(HI3519V101_DDR),(HI3519V101_SYS),(HI3519V101_VIVO),(HI3519V101_PER),(HI3519V101_VSS1),(HI3519V101_VSS2); CODE: G01428016_MODZH; %195%%232%%202%%246%: 请注意是HDI板，建库的时候请注意下-02323838; COMPONENT_HIGH_MAX: 0.98MM; CaptureCellPackProp: HI3519V101_PERA; FORWARD_PCB: 1; PKG_TYPE: HBGA524-16-2424; GVALUE: HI3519V101_PER
*#5 = GOSPELL: Cage Code: 2017